# EAGLE design CC-FlexiMIDI-V1R2-12.29.2019 (EAGLE 5.10)

## Sheet 1 of 7
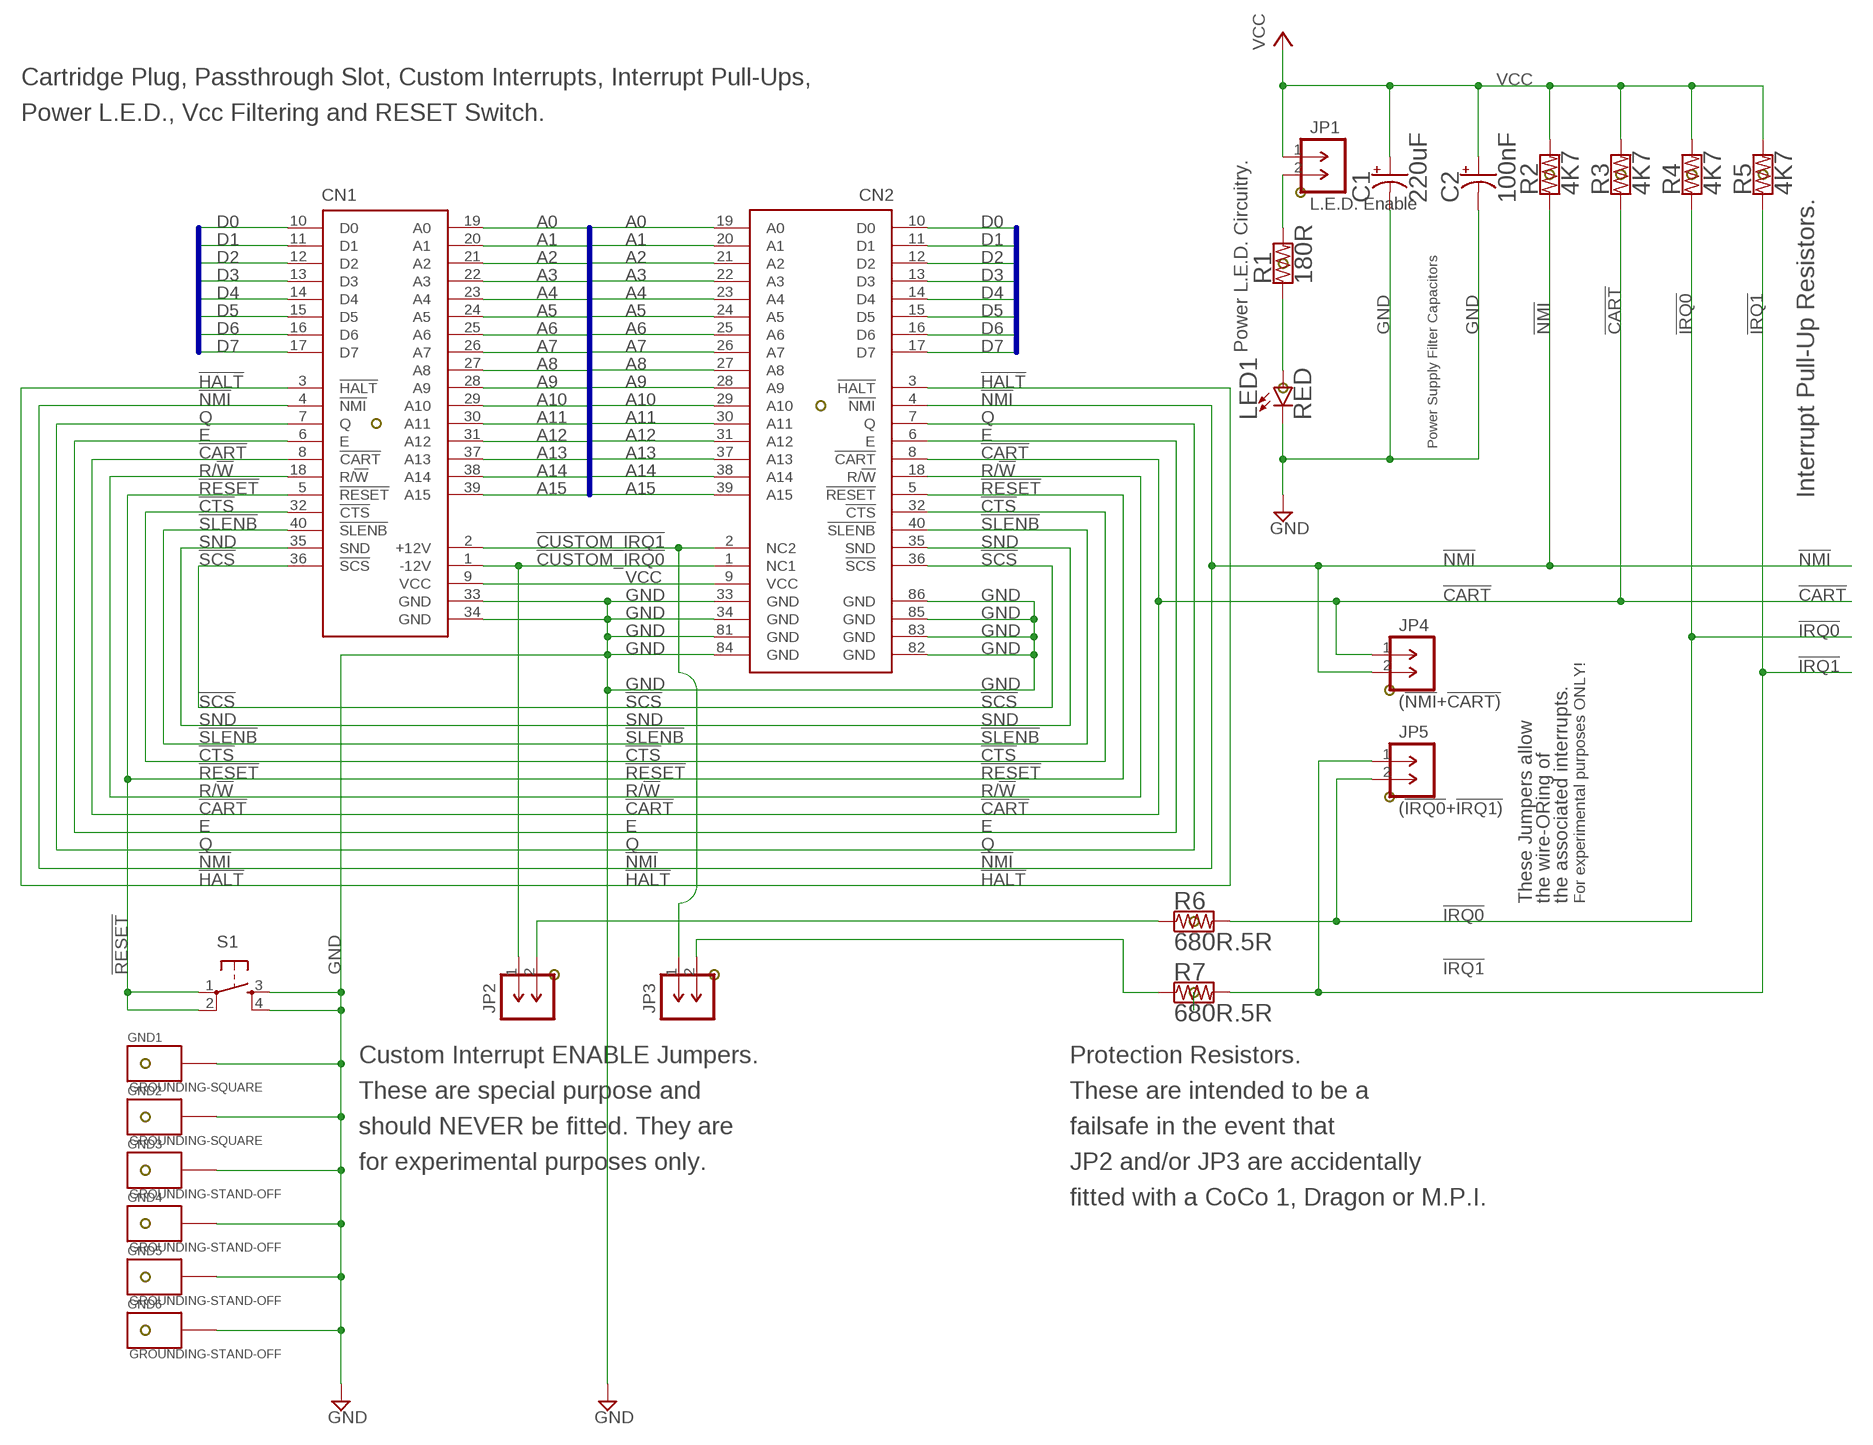
[diagram p0: schematic, sheet 1]

### Parts
C1  220uF  +CAPACITOR--25V2  [25V2]
C2  100nF  +CAPACITOR--PTH1  [PTH1]
CN1  COCO3-CARTRIDGE-PLUG-MEDIUM  [EDGE-CARD-PLUG-2X20-100-MEDIUM]
CN2  COCO3-CARTRIDGE-SLOT-HEADER/SLOT-40  [HEADER/EDGE-CARD-RECEPTACLE-2X20-100-STRAIGHT-W/EARS]
GND1  GROUNDING-SQUARE  [SQUARE]
GND2  GROUNDING-SQUARE  [SQUARE]
GND3  GROUNDING-STAND-OFF  [STAND-OFF]
GND4  GROUNDING-STAND-OFF  [STAND-OFF]
GND5  GROUNDING-STAND-OFF  [STAND-OFF]
GND6  GROUNDING-STAND-OFF  [STAND-OFF]
JP1  L.E.D. Enable  1X02-SIP-100-32  [SIL1X02-100]
JP2  1X02-SIP-100-32  [SIL1X02-100]
JP3  1X02-SIP-100-32  [SIL1X02-100]
JP4  (!NMI!+!CART)  1X02-SIP-100-32  [SIL1X02-100]
JP5  (!IRQ0!+!IRQ1)  1X02-SIP-100-32  [SIL1X02-100]
LED1  RED  LED-5MM  [LT1-3/4]
R1  180R  RESISTOR-LCR5  [LCR5]
R2  4K7  RESISTOR-LCR5  [LCR5]
R3  4K7  RESISTOR-LCR5  [LCR5]
R4  4K7  RESISTOR-LCR5  [LCR5]
R5  4K7  RESISTOR-LCR5  [LCR5]
R6  680R.5R  RESISTOR-R5-PTH  [R5-PTH]
R7  680R.5R  RESISTOR-R5-PTH  [R5-PTH]
S1  RESET  TAC_SWITCHPTH  [TACTILE-PTH]

### Nets
!CART: CN1.8(!CART) CN2.8(!CART) JP4.1 R3.1 ; also sheet 4
!CTS: CN1.32(!CTS) CN2.32(!CTS)
!CUSTOM_IRQ0 [power]: CN1.1(-12V) CN2.1(NC1) JP2.1
!CUSTOM_IRQ1 [power]: CN1.2(+12V) CN2.2(NC2) JP3.1
!HALT: CN1.3(!HALT) CN2.3(!HALT)
!IRQ0: JP5.2 R4.1 R6.2 ; also sheet 4
!IRQ1: JP5.1 R5.1 R7.2 ; also sheet 4
!NMI: CN1.4(!NMI) CN2.4(!NMI) JP4.2 R2.1 ; also sheet 4
!RESET: CN1.5(!RESET) CN2.5(!RESET) S1.1 S1.2 ; also sheet 2,3,4
!SCS: CN1.36(!SCS) CN2.36(!SCS)
!SLENB: CN1.40(!SLENB) CN2.40(!SLENB)
A0: CN1.19(A0) CN2.19(A0) ; also sheet 4
A1: CN1.20(A1) CN2.20(A1) ; also sheet 3
A2: CN1.21(A2) CN2.21(A2) ; also sheet 3
A3: CN1.22(A3) CN2.22(A3) ; also sheet 3
A4: CN1.23(A4) CN2.23(A4) ; also sheet 3
A5: CN1.24(A5) CN2.24(A5) ; also sheet 3
A6: CN1.25(A6) CN2.25(A6) ; also sheet 3
A7: CN1.26(A7) CN2.26(A7) ; also sheet 3
A8: CN1.27(A8) CN2.27(A8) ; also sheet 3
A9: CN1.28(A9) CN2.28(A9) ; also sheet 3
A10: CN1.29(A10) CN2.29(A10) ; also sheet 3
A11: CN1.30(A11) CN2.30(A11) ; also sheet 3
A12: CN1.31(A12) CN2.31(A12) ; also sheet 3
A13: CN1.37(A13) CN2.37(A13) ; also sheet 3
A14: CN1.38(A14) CN2.38(A14) ; also sheet 3
A15: CN1.39(A15) CN2.39(A15) ; also sheet 3
D0: CN1.10(D0) CN2.10(D0) ; also sheet 4
D1: CN1.11(D1) CN2.11(D1) ; also sheet 4
D2: CN1.12(D2) CN2.12(D2) ; also sheet 4
D3: CN1.13(D3) CN2.13(D3) ; also sheet 4
D4: CN1.14(D4) CN2.14(D4) ; also sheet 4
D5: CN1.15(D5) CN2.15(D5) ; also sheet 4
D6: CN1.16(D6) CN2.16(D6) ; also sheet 4
D7: CN1.17(D7) CN2.17(D7) ; also sheet 4
E: CN1.6(E) CN2.6(E) ; also sheet 3,4
GND [power]: C1.- C2.- CN1.33(GND) CN1.34(GND) CN2.33(GND) CN2.34(GND) CN2.81(GND) CN2.82(GND) CN2.83(GND) CN2.84(GND) CN2.85(GND) CN2.86(GND) GND1.GND GND2.GND GND3.GND GND4.GND GND5.GND GND6.GND LED1.-(C) S1.3 S1.4 ; also sheet 2,3,4,5,6,7
N$1: LED1.+(A) R1.1
N$2: JP1.2 R1.2
N$3 [power]: JP2.2 R6.1
N$4 [power]: JP3.2 R7.1
Q: CN1.7(Q) CN2.7(Q)
R/!W: CN1.18(R/!W) CN2.18(R/!W) ; also sheet 4
SND: CN1.35(SND) CN2.35(SND)
VCC [power]: C1.+ C2.+ CN1.9(VCC) CN2.9(VCC) JP1.1 R2.2 R3.2 R4.2 R5.2 ; also sheet 2,3,4,5,6,7

### Buses
A[0..15]
D[0..7]

### Notes on the sheet
- Cartridge Plug, Passthrough Slot, Custom Interrupts, Interrupt Pull-Ups,
- Power L.E.D., Vcc Filtering and RESET Switch.
- Power L.E.D. Circuitry.
- Power Supply Filter Capacitors
- Interrupt Pull-Up Resistors.
- These Jumpers allow | the wire-ORing of | the associated interrupts. | For experimental purposes ONLY!
- Custom Interrupt ENABLE Jumpers. | Protection Resistors.
- These are special purpose and | These are intended to be a
- should NEVER be fitted. They are | failsafe in the event that
- for experimental purposes only. | JP2 and/or JP3 are accidentally
- fitted with a CoCo 1, Dragon or M.P.I.

## Sheet 2 of 7
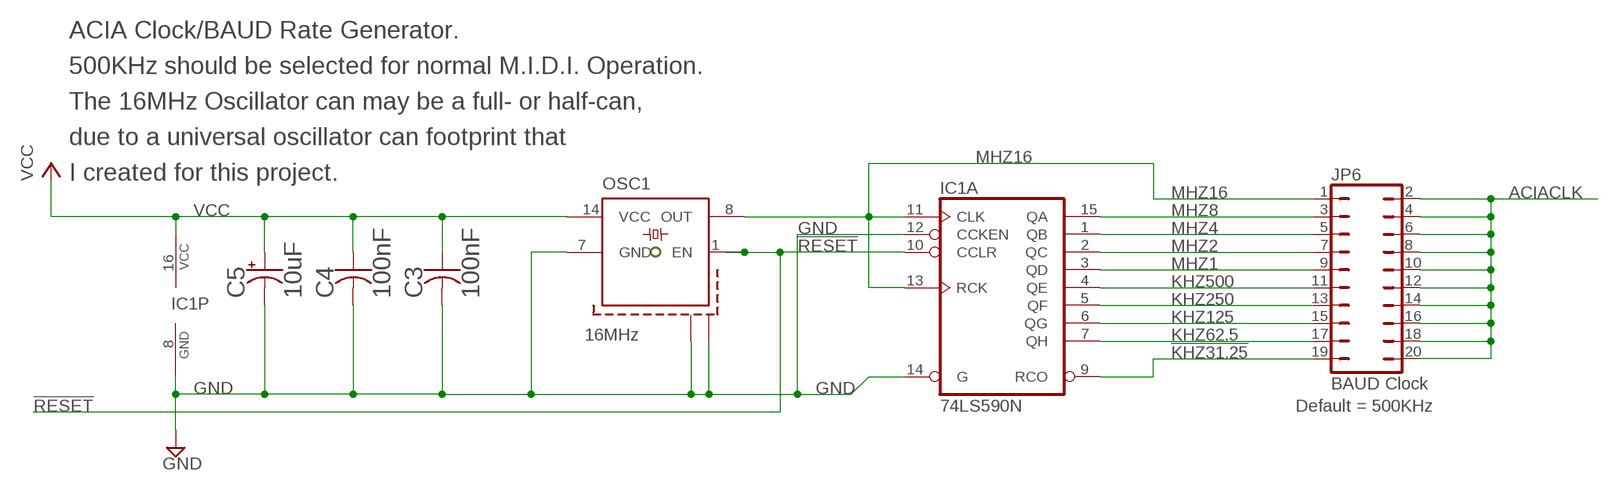
[diagram p1: schematic, sheet 2]

### Parts
C3  100nF  CAPACITOR-PTH1  [PTH1]
C4  100nF  CAPACITOR-PTH1  [PTH1]
C5  10uF  +CAPACITOR--25V1  [25V1]
IC1  74LS590N  [DIL16-3-TOP]
JP6  BAUD Clock  JP10Q  [JP10Q]
OSC1  16MHz  OSC-1  [OSC-TOP]

### Nets
!KHZ31.25: IC1.9(A:RCO) JP6.19
!RESET: IC1.10(A:CCLR) OSC1.1(EN) OSC1.4(EN) ; also sheet 1,3,4
ACIACLK: JP6.2 JP6.4 JP6.6 JP6.8 JP6.10 JP6.12 JP6.14 JP6.16 JP6.18 JP6.20 ; also sheet 4
GND [power]: C3.- C4.- C5.- IC1.8(P:GND) IC1.12(A:CCKEN) IC1.14(A:G) OSC1.7(GND) OSC1.S OSC1.S@1(S) ; also sheet 1,3,4,5,6,7
KHZ62.5: IC1.7(A:QH) JP6.17
KHZ125: IC1.6(A:QG) JP6.15
KHZ250: IC1.5(A:QF) JP6.13
KHZ500: IC1.4(A:QE) JP6.11
MHZ1: IC1.3(A:QD) JP6.9
MHZ2: IC1.2(A:QC) JP6.7
MHZ4: IC1.1(A:QB) JP6.5
MHZ8: IC1.15(A:QA) JP6.3
MHZ16: IC1.11(A:CLK) IC1.13(A:RCK) JP6.1 OSC1.8(OUT)
VCC [power]: C3.+ C4.+ C5.+ IC1.16(P:VCC) OSC1.11(VCC) ; also sheet 1,3,4,5,6,7

### Notes on the sheet
- ACIA Clock/BAUD Rate Generator.
- 500KHz should be selected for normal M.I.D.I. Operation.
- The 16MHz Oscillator can may be a full- or half-can,
- due to a universal oscillator can footprint that
- I created for this project.
- Default = 500KHz

## Sheet 3 of 7
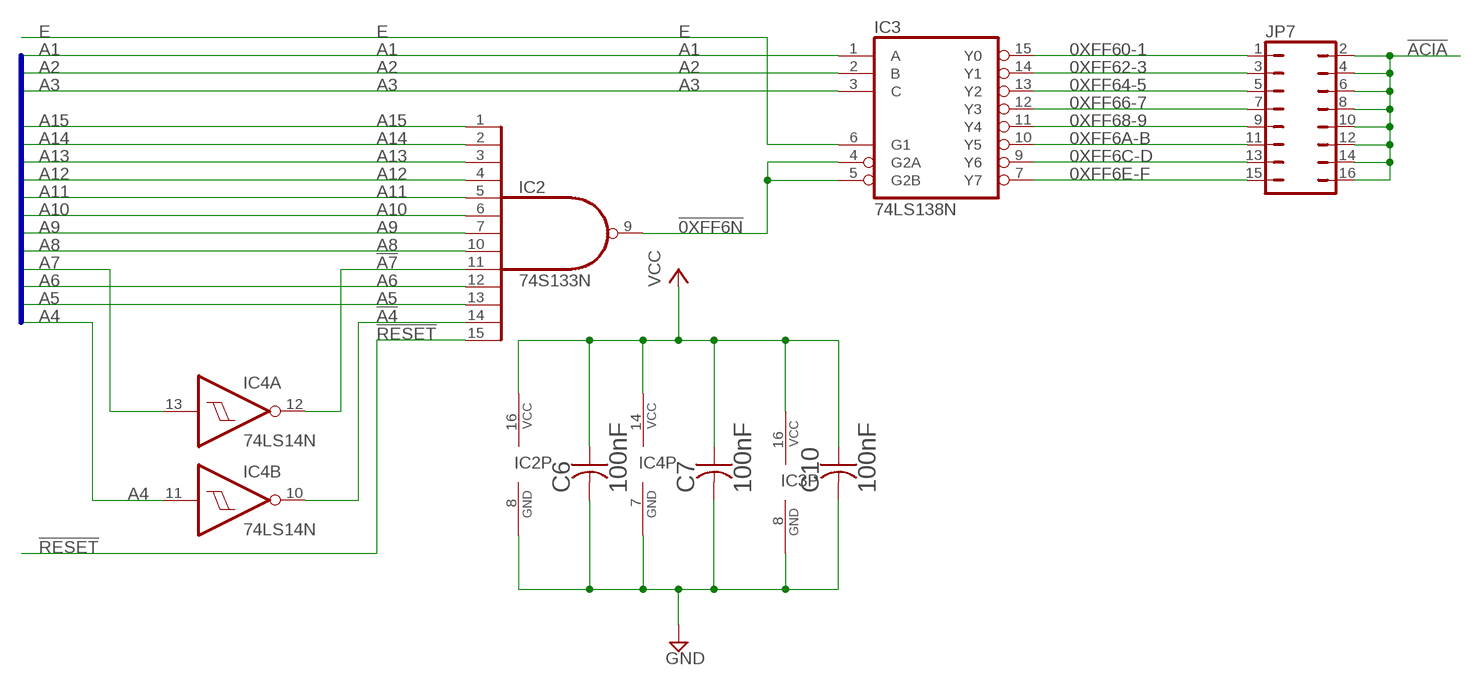
[diagram p2: schematic, sheet 3]

### Parts
C6  100nF  CAPACITOR-PTH1  [PTH1]
C7  100nF  CAPACITOR-PTH1  [PTH1]
C10  100nF  CAPACITOR-PTH1  [PTH1]
IC2  74S133N  [DIL16-3]
IC3  74LS138N  [DIL16-3]
IC4  74LS14N  [DIL14-3-TOP]
JP7  JP8Q  [JP8Q]

### Nets
0XFF6A-B: IC3.10(Y5) JP7.11
0XFF6C-D: IC3.9(Y6) JP7.13
0XFF6E-F: IC3.7(Y7) JP7.15
0XFF60-1: IC3.15(Y0) JP7.1
0XFF62-3: IC3.14(Y1) JP7.3
0XFF64-5: IC3.13(Y2) JP7.5
0XFF66-7: IC3.12(Y3) JP7.7
0XFF68-9: IC3.11(Y4) JP7.9
!0XFF6N: IC2.9(O) IC3.4(G2A) IC3.5(G2B)
!A4: IC2.14(I11) IC4.10(B:O)
!A7: IC2.11(I8) IC4.12(A:O)
!ACIA: JP7.2 JP7.4 JP7.6 JP7.8 JP7.10 JP7.12 JP7.14 JP7.16 ; also sheet 4
!RESET: IC2.15(I12) ; also sheet 1,2,4
A1: IC3.1(A) ; also sheet 1
A2: IC3.2(B) ; also sheet 1
A3: IC3.3(C) ; also sheet 1
A4: IC4.11(B:I) ; also sheet 1
A5: IC2.13(I10) ; also sheet 1
A6: IC2.12(I9) ; also sheet 1
A7: IC4.13(A:I) ; also sheet 1
A8: IC2.10(I7) ; also sheet 1
A9: IC2.7(I6) ; also sheet 1
A10: IC2.6(I5) ; also sheet 1
A11: IC2.5(I4) ; also sheet 1
A12: IC2.4(I3) ; also sheet 1
A13: IC2.3(I2) ; also sheet 1
A14: IC2.2(I1) ; also sheet 1
A15: IC2.1(I0) ; also sheet 1
E: IC3.6(G1) ; also sheet 1,4
GND [power]: C6.- C7.- C10.- IC2.8(GND) IC3.8(GND) IC4.7(P:GND) ; also sheet 1,2,4,5,6,7
VCC [power]: C6.+ C7.+ C10.+ IC2.16(VCC) IC3.16(VCC) IC4.14(P:VCC) ; also sheet 1,2,4,5,6,7

### Buses
A[0..15]

## Sheet 4 of 7
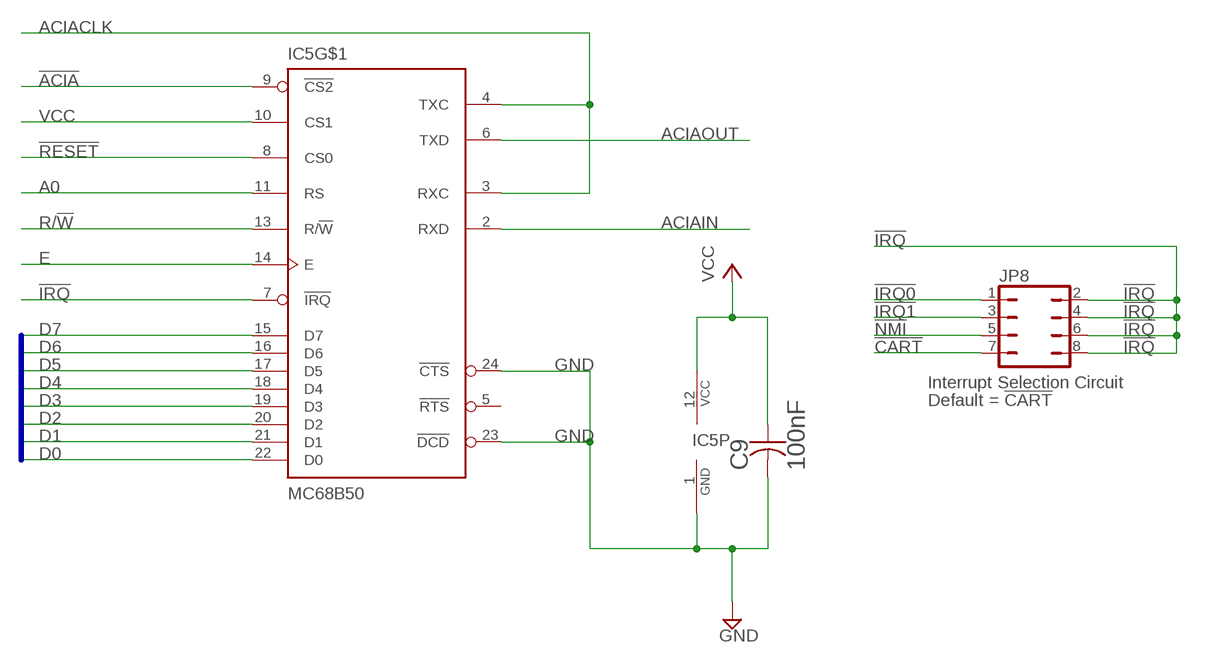
[diagram p3: schematic, sheet 4]

### Parts
C9  100nF  CAPACITOR-PTH1  [PTH1]
IC5  MC68B50  6850P  [DIL24-6]
JP8  JP4Q  [JP4Q]

### Nets
!ACIA: IC5.9(!CS2) ; also sheet 3
!CART: JP8.7 ; also sheet 1
!IRQ: IC5.7(!IRQ) JP8.2 JP8.4 JP8.6 JP8.8
!IRQ0: JP8.1 ; also sheet 1
!IRQ1: JP8.3 ; also sheet 1
!NMI: JP8.5 ; also sheet 1
!RESET: IC5.8(CS0) ; also sheet 1,2,3
A0: IC5.11(RS) ; also sheet 1
ACIACLK: IC5.3(RXC) IC5.4(TXC) ; also sheet 2
ACIAIN: IC5.2(RXD) ; also sheet 5,7
ACIAOUT: IC5.6(TXD) ; also sheet 6
D0: IC5.22(D0) ; also sheet 1
D1: IC5.21(D1) ; also sheet 1
D2: IC5.20(D2) ; also sheet 1
D3: IC5.19(D3) ; also sheet 1
D4: IC5.18(D4) ; also sheet 1
D5: IC5.17(D5) ; also sheet 1
D6: IC5.16(D6) ; also sheet 1
D7: IC5.15(D7) ; also sheet 1
E: IC5.14(E) ; also sheet 1,3
GND [power]: C9.- IC5.1(P:GND) IC5.23(!DCD) IC5.24(!CTS) ; also sheet 1,2,3,5,6,7
R/!W: IC5.13(R/!W) ; also sheet 1
VCC [power]: C9.+ IC5.10(CS1) IC5.12(P:VCC) ; also sheet 1,2,3,5,6,7
Unconnected: IC5.5(!RTS)

### Buses
D[0..7]

### Notes on the sheet
- Interrupt Selection Circuit
- Default = !CART

## Sheet 5 of 7
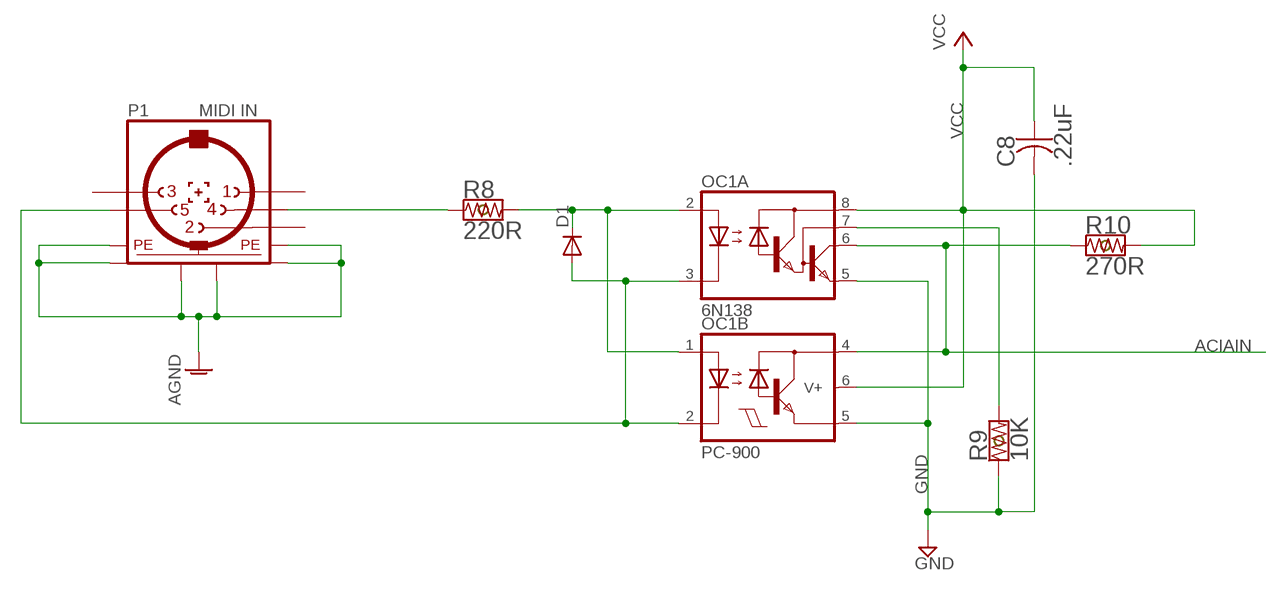
[diagram p4: schematic, sheet 5]

### Parts
C8  .22uF  CAPACITOR-PTH1  [PTH1]
D1  1N4148DO35-7  [DO35-7]
OC1A  6N138  6N138-T  [DIL08-3-TOP]
OC1B  PC-900  [DIL06-3-TOP]
P1  MIDI IN  5-PIN-90-DEGREE-FEMALE-DIN-5P90D  [5-PIN-90-DEGREE-FEMALE-DIN]
R8  220R  RESISTOR-LCR5  [LCR5]
R9  10K  RESISTOR-LCR5  [LCR5]
R10  270R  RESISTOR-LCR5  [LCR5]

### Nets
ACIAIN: OC1A.6(VO) OC1B.4(COLLECTOR) R10.1 ; also sheet 4,7
AGND [power]: P1.PE@1(PE) P1.PE@2(PE) P1.PE@3(PE) P1.PE@4(PE) P1.PE@5(PE) P1.PE@6(PE)
GND [power]: C8.- OC1A.5(GND) OC1B.5(EMITTER) R9.1 ; also sheet 1,2,3,4,6,7
N$13: D1.C OC1A.2(A) OC1B.1(A) R8.2
N$14: D1.A OC1A.3(C) OC1B.2(C) P1.5
N$18: P1.4 R8.1
N$19: OC1A.7(VB) R9.2
VCC [power]: C8.+ OC1A.8(VCC) OC1B.6(V+) R10.2 ; also sheet 1,2,3,4,6,7
Unconnected: P1.1 P1.2 P1.3

## Sheet 6 of 7
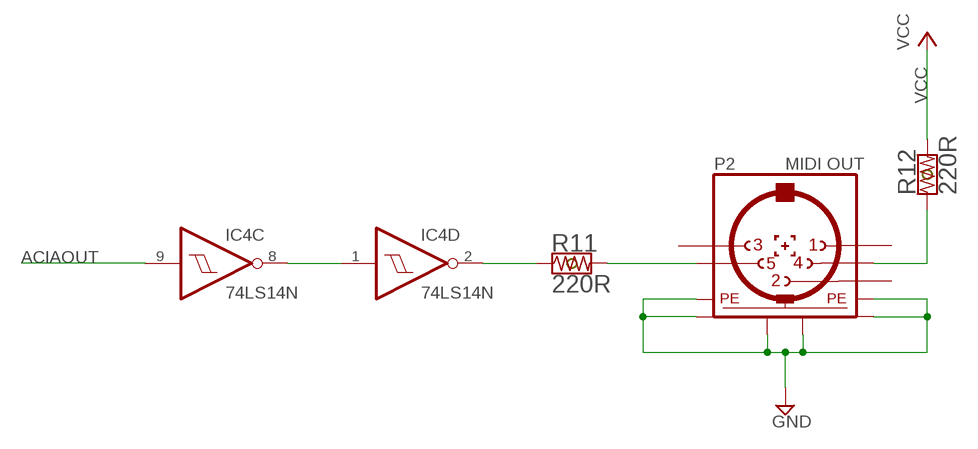
[diagram p5: schematic, sheet 6]

### Parts
P2  MIDI OUT  5-PIN-90-DEGREE-FEMALE-DIN-5P90D  [5-PIN-90-DEGREE-FEMALE-DIN]
R11  220R  RESISTOR-LCR5  [LCR5]
R12  220R  RESISTOR-LCR5  [LCR5]

### Nets
ACIAOUT: IC4.9(C:I) ; also sheet 4
GND [power]: P2.PE@1(PE) P2.PE@2(PE) P2.PE@3(PE) P2.PE@4(PE) P2.PE@5(PE) P2.PE@6(PE) ; also sheet 1,2,3,4,5,7
N$15: IC4.1(D:I) IC4.8(C:O)
N$16: IC4.2(D:O) R11.1
N$17: P2.5 R11.2
N$20: P2.4 R12.1
VCC [power]: R12.2 ; also sheet 1,2,3,4,5,7
Unconnected: P2.1 P2.2 P2.3

## Sheet 7 of 7
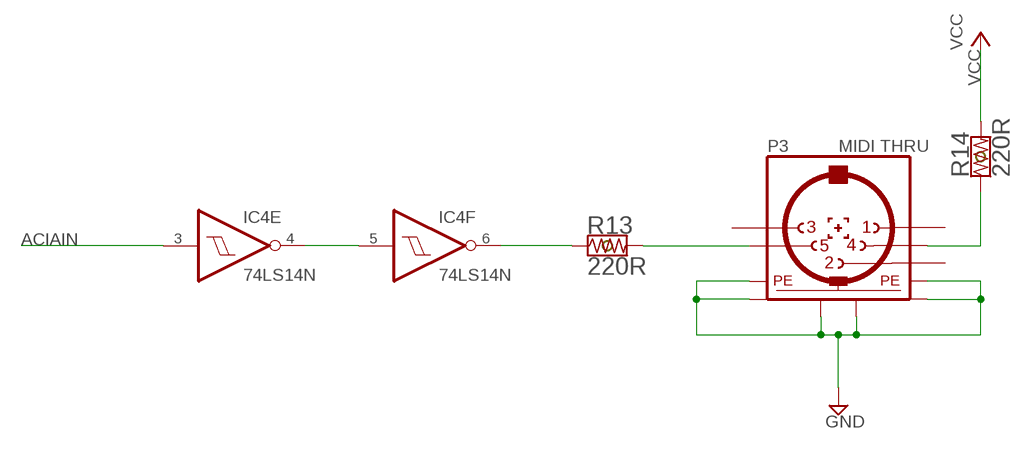
[diagram p6: schematic, sheet 7]

### Parts
P3  MIDI THRU  5-PIN-90-DEGREE-FEMALE-DIN-5P90D  [5-PIN-90-DEGREE-FEMALE-DIN]
R13  220R  RESISTOR-LCR5  [LCR5]
R14  220R  RESISTOR-LCR5  [LCR5]

### Nets
ACIAIN: IC4.3(E:I) ; also sheet 4,5
GND [power]: P3.PE@1(PE) P3.PE@2(PE) P3.PE@3(PE) P3.PE@4(PE) P3.PE@5(PE) P3.PE@6(PE) ; also sheet 1,2,3,4,5,6
N$21: P3.4 R14.1
N$22: P3.5 R13.2
N$23: IC4.6(F:O) R13.1
N$24: IC4.4(E:O) IC4.5(F:I)
VCC [power]: R14.2 ; also sheet 1,2,3,4,5,6
Unconnected: P3.1 P3.2 P3.3

## Power pins joined to a net without a drawn wire
VCC: OSC1.14(VCC)

## Library data of the parts
C1 C2 C5 = CC-FlexiMIDI-V1R1-03.09.2009:+CAPACITOR-: Capacitor Polarized These are standard SMD and PTH capacitors. Normally 10uF, 47uF, and 100uF in electrolytic and tantalum varieties. Always verify the external diameter of the through hole cap, it varies with capacity, voltage, and manufacturer. The EIA devices should be standard.
C3 C4 C6-C10 = CC-FlexiMIDI-V1R1-03.09.2009:CAPACITOR: NON-POLARIZED CAPACITOR grid 5mm
CN1 = CC-FlexiMIDI-V1R1-03.09.2009:COCO3-CARTRIDGE-PLUG: CoCo 3 Program Pak Cartridge Plug - http://www.GIMEchip.com/ Tandy Radio Shack TRS-80 Color Computer 3 Program Pak Cartridge Plug (Edge-Card) E.A.G.L.E. Library Part created by John Eric Turner & His Father - sales@gimechip.com <mailto:sales@gimechip.com?subject=Tandy Radio Shack TRS- 80 Color Computer 3 Program Pak Cartridge Plug (Edge-Card) E.A.G.L.E. Library Part> 40-Pin Edge-Card sharing the same pinout as the Program Pak Cartridge Edge-Card Connector. This library part has been designed to provide a 40-pin cartridge plug connector matching the CoCo's Edge-Card connector (Cartridge Slot). This library part is also useful with the Dragon and other CoCo clones. It is important to note that the CoCo 2 & 3 only provide +5V at the cartridge connector. The CoCo 1 provides +5V AND +/-12V at the cartridge connector. The Dragon provides only +5V and +12V at the cartridge connector. The table below lists all similarities and differences between these machines, relevant to the cartridge slot: PIN # TRS-80 "CoCo 1" Function Tano/Dragon Data "Dragon 32/64" Function TRS-80 "CoCo 2 & 3" Function 1 -12V +12V NC 2 +12V +12V NC 3 HALT* HALT* HALT* 4 NMI* NMI* NMI* 5 RESET* RESET* RESET* 6 E E E 7 Q Q Q 8 CART* CART* CART* 9 +5V +5V +5V 10 D0 D0 D0 11 D1 D1 D1 12 D2 D2 D2 13 D3 D3 D3 14 D4 D4 D4 15 D5 D5 D5 16 D6 D6 D6 17 D7 D7 D7 18 R/W* R/W* R/W* 19 A0 A0 A0 20 A1 A1 A1 21 A2 A2 A2 22 A3 A3 A3 23 A4 A4 A4 24 A5 A5 A5 25 A6 A6 A6 26 A7 A7 A7 27 A8 A8 A8 28 A9 A9 A9 29 A10 A10 A10 30 A11 A11 A11 31 A12 A12 A12 32 CTS* CSEL* CTS* 33 GND GND GND 34 GND GND GND 35 SND SND SND 36 SCS* P2* SCS* 37 A13 A13 A13 38 A14 A14 A14 39 A15 A15 A15 40 SLENB* DSD* SLENB*
CN2 = CC-FlexiMIDI-V1R1-03.09.2009:COCO3-CARTRIDGE-SLOT: CoCo 3 Program Pak Cartridge Slot HEADER/SLOT - http://www.GIMEchip.com/ Tandy Radio Shack TRS-80 Color Computer 3 Program Pak Cartridge Slot HEADER/SLOT E.A.G.L.E. Library Part created by John Eric Turner & His Father - sales@gimechip.com <mailto:sales@gimechip.com?subject=Tandy Radio Shack TRS- 80 Color Computer 3 Program Pak Cartridge Slot E.A.G.L.E. Library Part> 40-Pin Header and Slot sharing the same pinout as the Program Pak Cartridge Edge-Card Connector. This library part has been designed to provide a 40-pin cartridge slot connector matching the CoCo's Edge-Card connector (Cartridge Slot). This library part is also useful with the Dragon and other CoCo clones. It is important to note that the CoCo 2 & 3 only provide +5V at the cartridge connector. The CoCo 1 provides +5V AND +/-12V at the cartridge connector. The Dragon provides only +5V and +12V at the cartridge connector. The table below lists all similarities and differences between these machines, relevant to the cartridge slot: PIN # TRS-80 "CoCo 1" Function Tano/Dragon Data "Dragon 32/64" Function TRS-80 "CoCo 2 & 3" Function 1 -12V +12V NC 2 +12V +12V NC 3 HALT* HALT* HALT* 4 NMI* NMI* NMI* 5 RESET* RESET* RESET* 6 E E E 7 Q Q Q 8 CART* CART* CART* 9 +5V +5V +5V 10 D0 D0 D0 11 D1 D1 D1 12 D2 D2 D2 13 D3 D3 D3 14 D4 D4 D4 15 D5 D5 D5 16 D6 D6 D6 17 D7 D7 D7 18 R/W* R/W* R/W* 19 A0 A0 A0 20 A1 A1 A1 21 A2 A2 A2 22 A3 A3 A3 23 A4 A4 A4 24 A5 A5 A5 25 A6 A6 A6 26 A7 A7 A7 27 A8 A8 A8 28 A9 A9 A9 29 A10 A10 A10 30 A11 A11 A11 31 A12 A12 A12 32 CTS* CSEL* CTS* 33 GND GND GND 34 GND GND GND 35 SND SND SND 36 SCS* P2* SCS* 37 A13 A13 A13 38 A14 A14 A14 39 A15 A15 A15 40 SLENB* DSD* SLENB*
D1 = CC-FlexiMIDI-V1R1-03.09.2009:1N4148: DIODE high speed (Philips)
GND1-GND6 = CC-FlexiMIDI-V1R1-03.09.2009:GROUNDING
IC1 = CC-FlexiMIDI-V1R1-03.09.2009:74*590: 8-bit binary COUNTER, output register
IC2 = CC-FlexiMIDI-V1R1-03.09.2009:74*133: 13-input NAND gate
IC3 = CC-FlexiMIDI-V1R1-03.09.2009:74*138: 3-line to 8-line DECODER/DEMULTIPLEXER
IC4 = CC-FlexiMIDI-V1R1-03.09.2009:74*14: Hex schmitt trigger INVERTER
IC5 = CC-FlexiMIDI-V1R1-03.09.2009:6850: MC6850 - http://www.TCADT.com/ MC6850 - ASYNCHRONOUS COMMUNICATIONS INTERFACE ADAPTER (ACIA) E.A.G.L.E. Library Part created by Ivan Bliminse - TinCansAndDuctTape@OutLook.com <mailto:TinCansAndDuctTape@OutLook.com?subject=MC6850 - ASYNCHRONOUS COMMUNICATIONS INTERFACE ADAPTER (ACIA) E.A.G.L.E. Library Part> COMPATIBILITY This E.A.G.L.E. Library Part is compatible with all variants of the 6850 in the 24-pin DIP package, including the following: Manufacturer Type Process Clock Frequency Package Motorola Freescale Semiconductors MC6850L MC6850CL MC68A50L MC68A50CL MC68B50C MOS (N-CHANNEL, SILICON-GATE) 1.0 MHz 1.0 MHz 1.5 MHz 1.5 MHz 2.0 MHz Ceramic L Suffix Motorola Freescale Semiconductors MC6850S MC6850CS MC68A50S MC68A50CS MC68B50S MOS (N-CHANNEL, SILICON-GATE) 1.0 MHz 1.0 MHz 1.5 MHz 1.5 MHz 2.0 MHz Cerdip S Suffix Motorola Freescale Semiconductors MC6850P MC6850CP MC68A50P MC68A50CP MC68B50P MOS (N-CHANNEL, SILICON-GATE) 1.0 MHz 1.0 MHz 1.5 MHz 1.5 MHz 2.0 MHz Plastic P Suffix Hitachi Semiconductors HD6350P HD63A50P HD63B50P HD63C50P CMOS 1.0 MHz 1.5 MHz 2.0 MHz 3.0 MHz DP-24 Hitachi Semiconductors HD6350FP HD63A50FP HD63B50FP HD63C50FP CMOS 1.0 MHz 1.5 MHz 2.0 MHz 3.0 MHz FP-24D Hitachi Semiconductors HD6850 HD68A50 HD68B50 NMOS 1.0 MHz 1.5 MHz 2.0 MHz DC-24 Hitachi Semiconductors HD6850P HD68A50P HD68B50P NMOS 1.0 MHz 1.5 MHz 2.0 MHz DP-24 NOTE: The Hitachi "C" parts are officially rated at 3 MHz, however, they are designed to operate at up to 5 MHz clock speeds. MOTOROLA (FREESCALE) SEMICONDUCTORS MC6850 - MOS (N-CHANNEL, SILICON-GATE) ASYNCHRONOUS COMMUNICATIONS INTERFACE ADAPTER The MC6850 Asynchronous Communications Interface Adapter provides the data formatting and control to interface serial asynchronous data communications information to bus organized systems such as the MC6800 and MC6809 Microprocessing Units. The bus interface of the MC6850 includes select, enable, read/write, interrupt and bus interface logic to allow data transfer over an 8-bit bidirectional data bus. The parallel data of the bus system is serially transmitted and received by the asynchronous data interface, with proper formatting and error checking. The functional configuration of the ACIA is programmed via the data bus during system initialization. A programmable Control Register provides variable word lengths, clock division ratios, transmit control, receive control, and interrupt control. For peripheral or modem operation, three control lines are provided. These lines allow the ACIA to interface directly with the MC6860L 0-600 bps digital modem. FEATURES 8- and 9-Bit Transmission Optional Even and Odd Parity Parity, Overrun and Framing Error Checking Programmable Control Register Optional ÷ 1, ÷ 16, and ÷ 64 Clock Modes Up to 1.0 Mbps Transmission False Start Bit Deletion Peripheral/Modem Control Functions Double Buffered One- or Two-Stop Bit Operation HD6350/HD6850 Series ACIA (Asynchronous Communications Interface Adapter) HD6350 = CMOS, HD6850 = NMOS The HD6350/HD6850 Asynchronous Communications Interface Adapter provides the data formatting and control to interface serial asynchronous data communications information to bus organized systems such as the HMCS6800 Microprocessing Unit (MPU). The bus interface of the HD6350/HD6850 includes select, enable, read/writer, interrupt and bus interface logic to allow data transfer over an 8-bit bi-directional data bus. The parrallel data of the bus system is serially transmitted and received by the asynchronous data interface with proper formatting and error checking. The functional configuration of the ACIA is programmed via the data bus during system initialization. A programmable Control Register provides variable word lengths, clock division ratios, transmit control, receive control, and interrupt control. For peripheral or modern operation three control lines are provided. FEATURES Serial/Parallel Conversion of Data Seven and Eight-bit Transmission Optional Even and Odd Parity Parity, Overrun and Framing Error Checking Peripheral/Modem Control Functions (Clear to Send CTS, Request to Send RTS, Data Carrier Detect DCD) Optional ÷ 1, ÷ 16, and ÷ 64 Clock Modes One-or Two-Stop Bit Operation Double Buffered - HD6350 - Low-Power, High-Speed, High-Density CMOS Compatible with NMOS ACIA (HD6850) Wide Range Operating Voltage (VCC = 5V ±10%) Up to 1Mbps Transmission - HD6850 - Compatible with MC6850 and MC68A50 Up to 500Kbps Transmission
JP1-JP5 = CC-FlexiMIDI-V1R1-03.09.2009:1X02: MALE HEADER
JP6 = CC-FlexiMIDI-V1R1-03.09.2009:JP10Q: JUMPER
JP7 = CC-FlexiMIDI-V1R1-03.09.2009:JP8Q: JUMPER
JP8 = CC-FlexiMIDI-V1R1-03.09.2009:JP4Q: JUMPER
LED1 = CC-FlexiMIDI-V1R1-03.09.2009:LED: LEDs Standard schematic elements and footprints for 5mm, 3mm, 1206, and 0603 sized LEDs. 5mm - Spark Fun Electronics SKU : COM-00529 (and others)
OC1A = CC-FlexiMIDI-V1R1-03.09.2009:6N138: MOTOROLA OPTO COUPLER
OC1B = CC-FlexiMIDI-V1R1-03.09.2009:PC-900
OSC1 = CC-FlexiMIDI-V1R1-03.09.2009:OSC-1
P1-P3 = CC-FlexiMIDI-V1R2-12.29.2019:5-PIN-90-DEGREE-FEMALE-DIN: Female CONNECTOR 5 pins 90 deg. with shield, horizontal (DIN 41524)
R1-R14 = CC-FlexiMIDI-V1R1-03.09.2009:RESISTOR
S1 = CC-FlexiMIDI-V1R1-03.09.2009:TAC_SWITCH: Momentary Tactile Push Switch

## Net classes
0 default: width 0.203 mm, clearance 0.152 mm
1 power: width 0.762 mm, clearance 0.203 mm

## Board
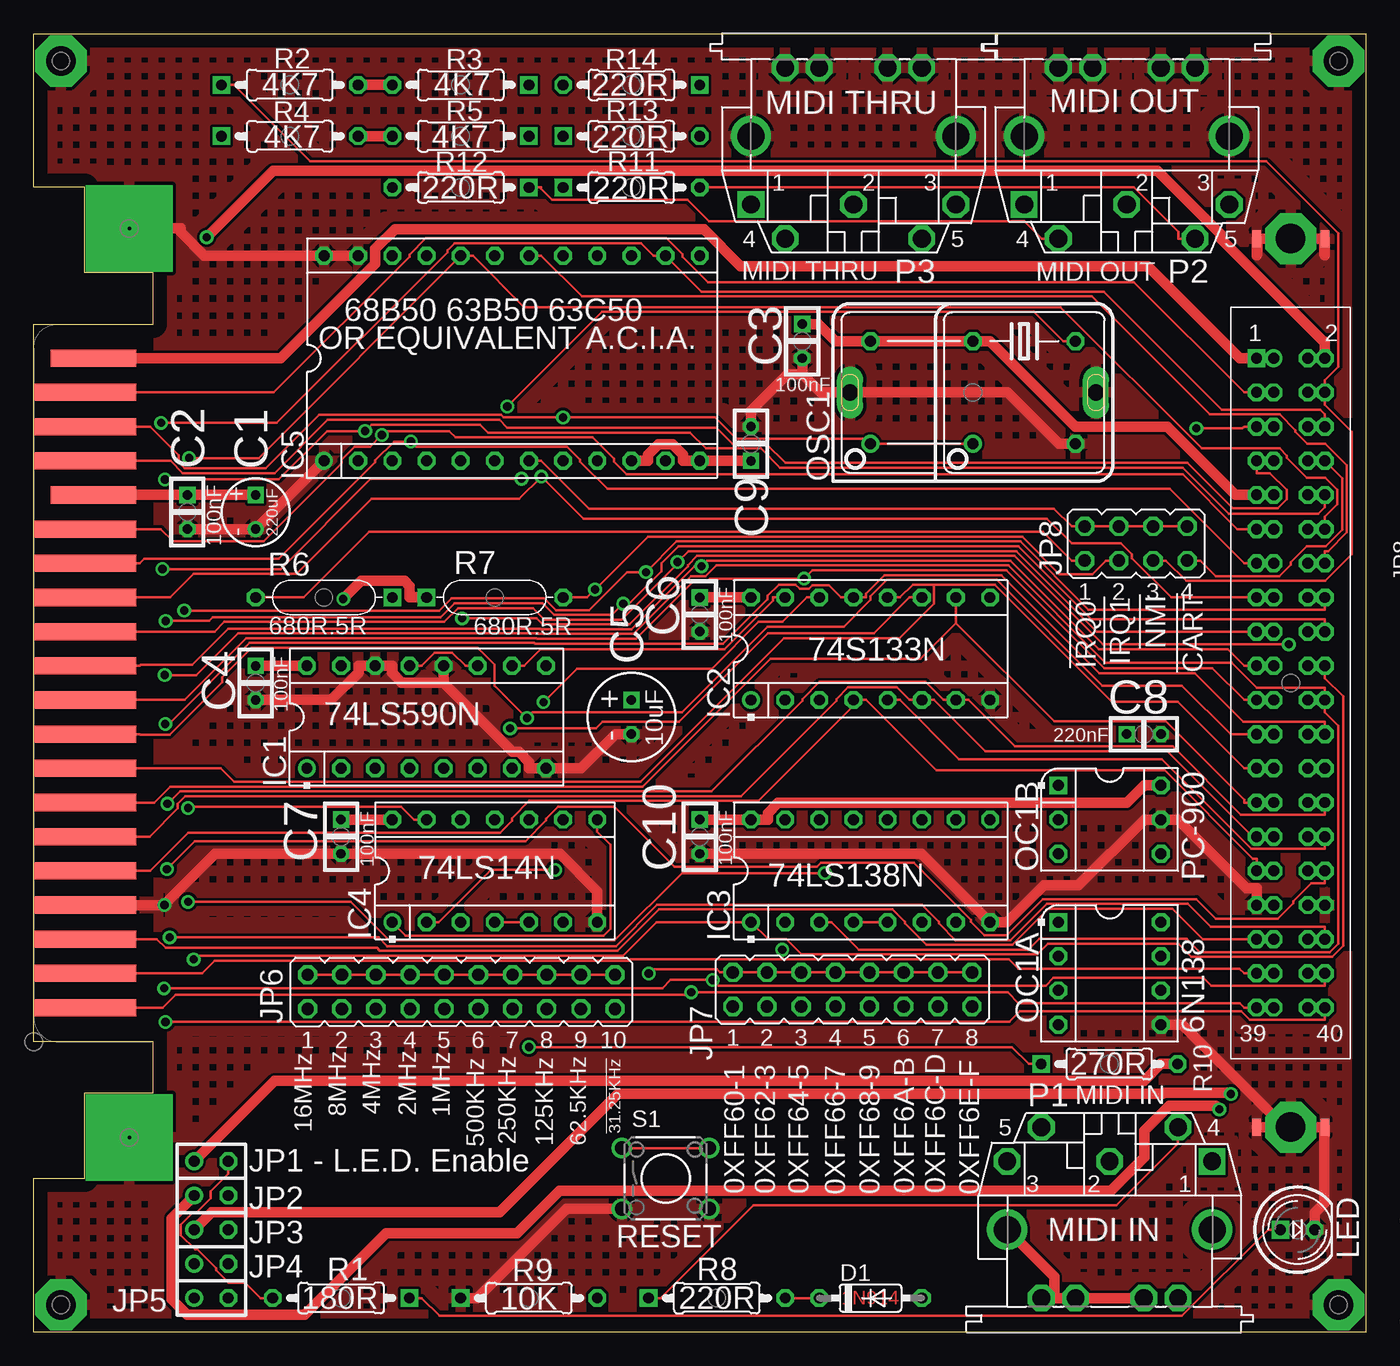
[diagram p7: board, top side]
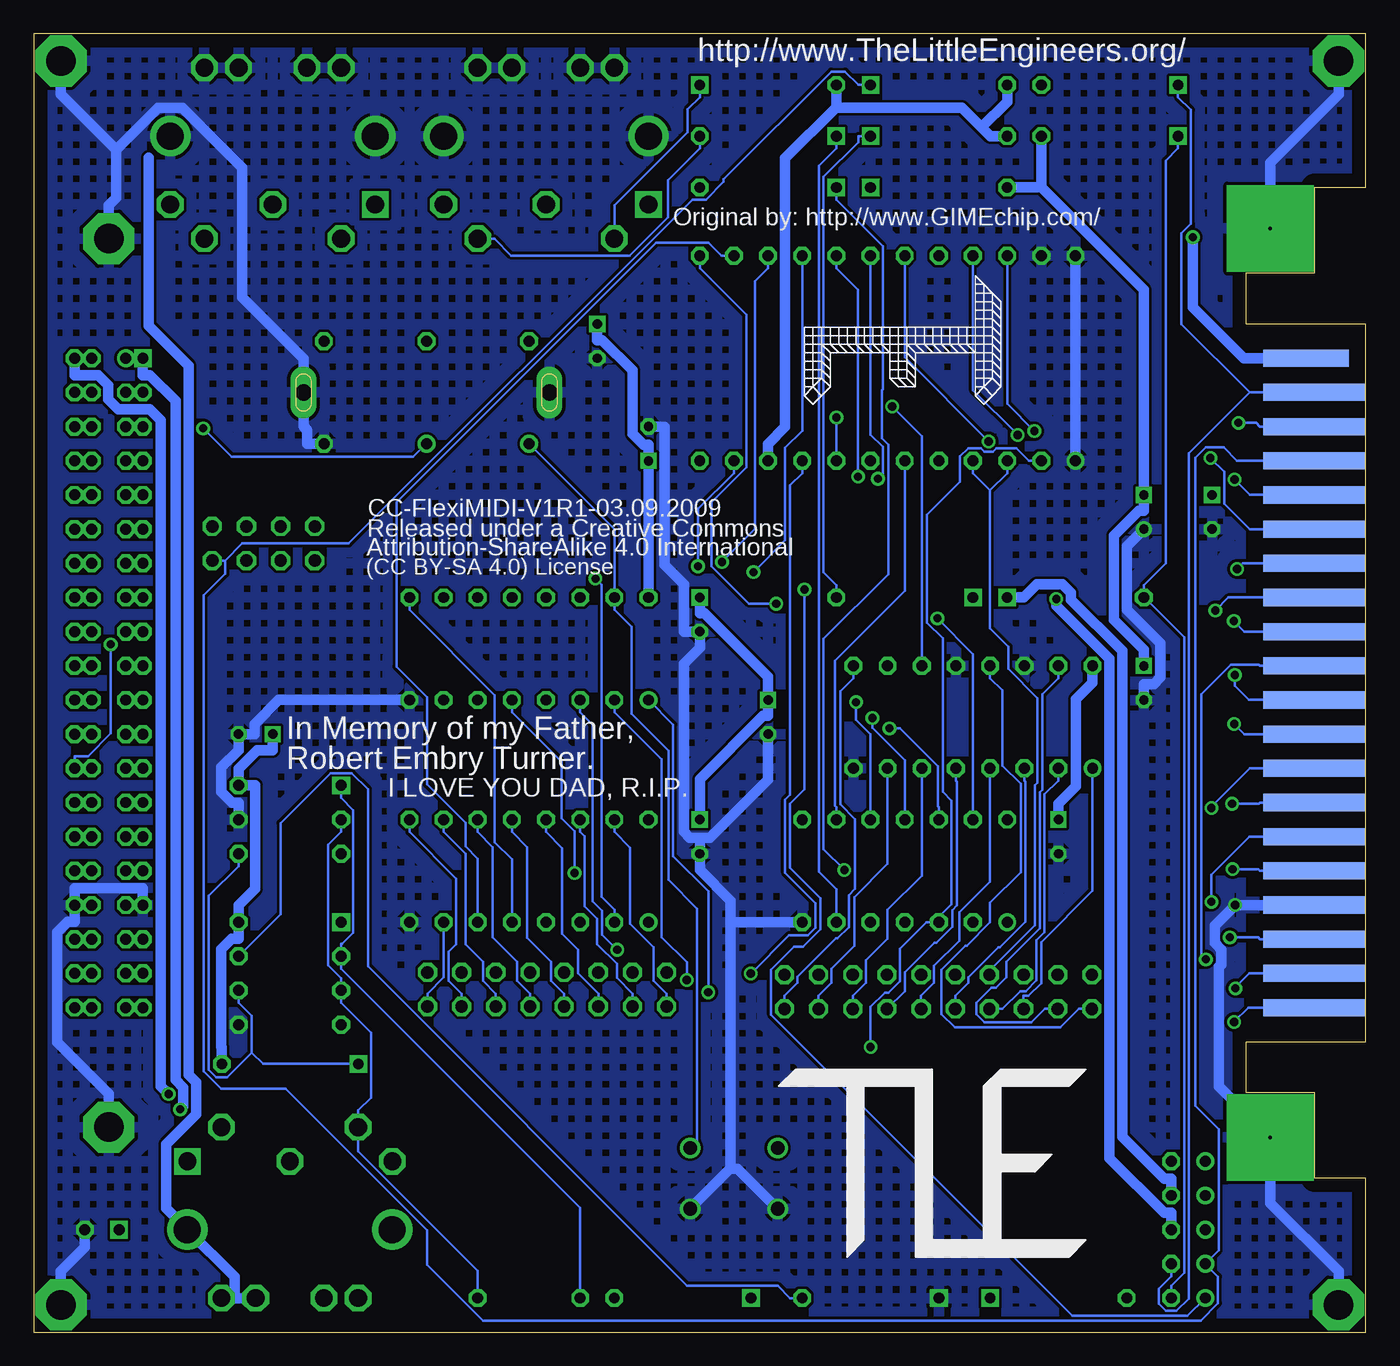
[diagram p8: board, bottom side, seen from below]

Size 99.06 x 96.52 mm. Coordinates in mm from the lower left corner, seen from the top.
Outline: 8.89,21.59 0,21.59 0,74.93 8.89,74.93 8.89,78.74 3.81,78.74 3.81,85.09 0,85.09 0,96.52 99.06,96.52 99.06,0 0,0 0,11.43 3.81,11.43 3.81,17.78 8.89,17.78 8.89,21.59
Copper layers (1*16): Top 0.035mm / dielectric 1.5mm / Bottom 0.035mm
Design rules "default": minimum track width 10mil, minimum drill 24mil, track to track 8mil, track to pad 8mil, pad to pad 8mil, via to via 8mil, smd to smd 8mil, copper to edge 40mil, drill to drill 8mil, minimum pad ring 10mil, minimum via ring 8mil, stop-mask expansion 4mil, vias tented up to drill 0mil, thermal gap 10mil

### Footprints (pad centres in the part's own frame; a part is rotated, then mirrored left to right if it is on the bottom)
25V2 = drill 0.7 square: + 1.27,0 | drill 0.7 round: - -1.27,0
PTH1 = drill 0.7 square: + -1.27,0 | drill 0.7 octagon: - 1.27,0
25V1 = drill 0.7 square: + 1.27,0 | drill 0.7 octagon: - -1.27,0
EDGE-CARD-PLUG-2X20-100-MEDIUM = smd 6.35 x 1.27: 1 4.445,50.8; 9 4.445,40.64 | smd 6.35 x 1.27 bottom: 2 4.445,50.8 | smd 7.62 x 1.27: 3 3.81,48.26; 5 3.81,45.72; 7 3.81,43.18; 11 3.81,38.1; 13 3.81,35.56; 15 3.81,33.02; 17 3.81,30.48; 19 3.81,27.94; 21 3.81,25.4; 23 3.81,22.86; 25 3.81,20.32; 27 3.81,17.78; 29 3.81,15.24; 31 3.81,12.7; 33 3.81,10.16; 35 3.81,7.62; 37 3.81,5.08; 39 3.81,2.54 | smd 7.62 x 1.27 bottom: 4 3.81,48.26; 6 3.81,45.72; 8 3.81,43.18; 10 3.81,40.64; 12 3.81,38.1; 14 3.81,35.56; 16 3.81,33.02; 18 3.81,30.48; 20 3.81,27.94; 22 3.81,25.4; 24 3.81,22.86; 26 3.81,20.32; 28 3.81,17.78; 30 3.81,15.24; 32 3.81,12.7; 34 3.81,10.16; 36 3.81,7.62; 38 3.81,5.08; 40 3.81,2.54
HEADER/EDGE-CARD-RECEPTACLE-2X20-100-STRAIGHT-W/EARS = drill 0.813 square: 1 -24.13,-2.54 | drill 0.813 octagon: 2 -24.13,2.54; 3 -21.59,-2.54; 4 -21.59,2.54; 5 -19.05,-2.54; 6 -19.05,2.54; 7 -16.51,-2.54; 8 -16.51,2.54; 9 -13.97,-2.54; 10 -13.97,2.54; 11 -11.43,-2.54; 12 -11.43,2.54; 13 -8.89,-2.54; 14 -8.89,2.54; 15 -6.35,-2.54; 16 -6.35,2.54; 17 -3.81,-2.54; 18 -3.81,2.54; 19 -1.27,-2.54; 20 -1.27,2.54; 21 1.27,-2.54; 22 1.27,2.54; 23 3.81,-2.54; 24 3.81,2.54; 25 6.35,-2.54; 26 6.35,2.54; 27 8.89,-2.54; 28 8.89,2.54; 29 11.43,-2.54; 30 11.43,2.54; 31 13.97,-2.54; 32 13.97,2.54; 33 16.51,-2.54; 34 16.51,2.54; 35 19.05,-2.54; 36 19.05,2.54; 37 21.59,-2.54; 38 21.59,2.54; 39 24.13,-2.54; 40 24.13,2.54; 42 -24.13,1.27; 43 -21.59,-1.27; 44 -21.59,1.27; 45 -19.05,-1.27; 46 -19.05,1.27; 47 -16.51,-1.27; 48 -16.51,1.27; 49 -13.97,-1.27; 50 -13.97,1.27; 51 -11.43,-1.27; 52 -11.43,1.27; 53 -8.89,-1.27; 54 -8.89,1.27; 55 -6.35,-1.27; 56 -6.35,1.27; 57 -3.81,-1.27; 58 -3.81,1.27; 59 -1.27,-1.27; 60 -1.27,1.27; 61 1.27,-1.27; 62 1.27,1.27; 63 3.81,-1.27; 64 3.81,1.27; 65 6.35,-1.27; 66 6.35,1.27; 67 8.89,-1.27; 68 8.89,1.27; 69 11.43,-1.27; 70 11.43,1.27; 71 13.97,-1.27; 72 13.97,1.27; 73 16.51,-1.27; 74 16.51,1.27; 75 19.05,-1.27; 76 19.05,1.27; 77 21.59,-1.27; 78 21.59,1.27; 79 24.13,-1.27; 80 24.13,1.27 | drill 0.813 round: 41 -24.13,-1.27 | drill 2.2 pad 3.81 octagon: 81 -33.02,0; 84 33.02,0 | smd 1.27 x 0.635: 82 -33.02,2.54; 83 -33.02,-2.54; 85 33.02,2.54; 86 33.02,-2.54
DO35-7 = drill 0.813 octagon: A 3.81,0; C -3.81,0
SQUARE = drill 0.254 pad 6.452 square: GND 0,0
STAND-OFF = drill 2.2 pad 3.81 octagon: GND 0,0
DIL16-3-TOP = drill 0.813 round: 1 -8.89,-3.81 | drill 0.813 octagon: 2 -6.35,-3.81; 3 -3.81,-3.81; 4 -1.27,-3.81; 5 1.27,-3.81; 6 3.81,-3.81; 7 6.35,-3.81; 8 8.89,-3.81; 9 8.89,3.81; 10 6.35,3.81; 11 3.81,3.81; 12 1.27,3.81; 13 -1.27,3.81; 14 -3.81,3.81; 15 -6.35,3.81; 16 -8.89,3.81
DIL16-3 = drill 0.813 round: 1 -8.89,-3.81 | drill 0.813 octagon: 2 -6.35,-3.81; 3 -3.81,-3.81; 4 -1.27,-3.81; 5 1.27,-3.81; 6 3.81,-3.81; 7 6.35,-3.81; 8 8.89,-3.81; 9 8.89,3.81; 10 6.35,3.81; 11 3.81,3.81; 12 1.27,3.81; 13 -1.27,3.81; 14 -3.81,3.81; 15 -6.35,3.81; 16 -8.89,3.81
DIL14-3-TOP = drill 0.813 round: 1 -7.62,-3.81 | drill 0.813 octagon: 2 -5.08,-3.81; 3 -2.54,-3.81; 4 0,-3.81; 5 2.54,-3.81; 6 5.08,-3.81; 7 7.62,-3.81; 8 7.62,3.81; 9 5.08,3.81; 10 2.54,3.81; 11 0,3.81; 12 -2.54,3.81; 13 -5.08,3.81; 14 -7.62,3.81
DIL24-6 = drill 0.813 round: 1 -13.97,-7.62 | drill 0.813 octagon: 2 -11.43,-7.62; 3 -8.89,-7.62; 4 -6.35,-7.62; 5 -3.81,-7.62; 6 -1.27,-7.62; 7 1.27,-7.62; 8 3.81,-7.62; 9 6.35,-7.62; 10 8.89,-7.62; 11 11.43,-7.62; 12 13.97,-7.62; 13 13.97,7.62; 14 11.43,7.62; 15 8.89,7.62; 16 6.35,7.62; 17 3.81,7.62; 18 1.27,7.62; 19 -1.27,7.62; 20 -3.81,7.62; 21 -6.35,7.62; 22 -8.89,7.62; 23 -11.43,7.62; 24 -13.97,7.62
SIL1X02-100 = drill 0.813 round: 1 -1.27,0 | drill 0.813 octagon: 2 1.27,0
JP10Q = drill 0.914 octagon: 1 -11.43,-1.27; 2 -11.43,1.27; 3 -8.89,-1.27; 4 -8.89,1.27; 5 -6.35,-1.27; 6 -6.35,1.27; 7 -3.81,-1.27; 8 -3.81,1.27; 9 -1.27,-1.27; 10 -1.27,1.27; 11 1.27,-1.27; 12 1.27,1.27; 13 3.81,-1.27; 14 3.81,1.27; 15 6.35,-1.27; 16 6.35,1.27; 17 8.89,-1.27; 18 8.89,1.27; 19 11.43,-1.27; 20 11.43,1.27
JP8Q = drill 0.914 octagon: 1 -8.89,-1.27; 2 -8.89,1.27; 3 -6.35,-1.27; 4 -6.35,1.27; 5 -3.81,-1.27; 6 -3.81,1.27; 7 -1.27,-1.27; 8 -1.27,1.27; 9 1.27,-1.27; 10 1.27,1.27; 11 3.81,-1.27; 12 3.81,1.27; 13 6.35,-1.27; 14 6.35,1.27; 15 8.89,-1.27; 16 8.89,1.27
JP4Q = drill 0.914 octagon: 1 -3.81,-1.27; 2 -3.81,1.27; 3 -1.27,-1.27; 4 -1.27,1.27; 5 1.27,-1.27; 6 1.27,1.27; 7 3.81,-1.27; 8 3.81,1.27
LT1-3/4 = drill 0.813 square: + -1.27,0 | drill 0.813 octagon: - 1.27,0
DIL08-3-TOP = drill 0.813 square: 1 -3.81,3.81 | drill 0.813 octagon: 2 -3.81,1.27; 3 -3.81,-1.27; 4 -3.81,-3.81; 5 3.81,-3.81; 6 3.81,-1.27; 7 3.81,1.27; 8 3.81,3.81
DIL06-3-TOP = drill 0.813 square: 1 -3.81,2.54 | drill 0.813 octagon: 2 -3.81,0; 3 -3.81,-2.54; 4 3.81,-2.54; 5 3.81,0; 6 3.81,2.54
OSC-TOP = drill 0.813 round: 1 -7.62,-3.81; 4 0,-3.81 | drill 0.813 octagon: 7 7.62,-3.81; 8 7.62,3.81; 11 0,3.81; 14 -7.62,3.81 | drill 1.2 pad 1.93 long: S -9.144,0; S@1 9.144,0
5-PIN-90-DEGREE-FEMALE-DIN = drill 1.321 square: 1 7.62,5.08 | drill 1.321 octagon: 2 0,5.08; 3 -7.62,5.08; 4 5.08,7.62; 5 -5.08,7.62; PE@1 -2.54,-5.08; PE@2 2.54,-5.08; PE@5 -5.08,-5.08; PE@6 5.08,-5.08 | drill 2 round: PE@3 7.62,0; PE@4 -7.62,0
LCR5 = drill 0.8 square: 1 -5.08,0 | drill 0.8 octagon: 2 5.08,0
R5-PTH = drill 0.8 square: 1 -5.08,0 | drill 0.8 octagon: 2 5.08,0
TACTILE-PTH = drill 1.016 round: 1 -3.251,2.261; 2 3.251,2.261; 3 -3.251,-2.261; 4 3.251,-2.261

### Placement (x,y rotation side)
C1  16.51,60.96 90 top
C2  11.43,60.96 270 top
C3  57.15,73.66 270 top
C4  16.51,48.26 270 top
C5  44.45,45.72 90 top
C6  49.53,53.34 270 top
C7  22.86,36.83 270 top
C8  82.55,44.45 0 top
C9  53.34,66.04 90 top
C10  49.53,36.83 270 top
CN1  0,21.59 0 top
CN2  93.47,48.26 270 top
D1  62.23,2.54 0 top
GND1  7.11,14.48 0 top
GND2  7.11,82.04 0 top
GND3  2.03,94.49 0 top
GND4  97.03,94.49 0 top
GND5  2.03,2.03 0 top
GND6  97.03,2.03 0 top
IC1  29.21,45.72 0 top
IC2  62.23,50.8 0 top
IC3  62.23,34.29 0 top
IC4  34.29,34.29 0 top
IC5  35.56,72.39 0 top
JP1  13.21,12.7 0 top
JP2  13.21,10.16 0 top
JP3  13.21,7.62 0 top
JP4  13.21,5.08 0 top
JP5  13.21,2.54 0 top
JP6  31.8,25.3 0 top
JP7  60.88,25.48 0 top
JP8  81.97,58.62 0 top
LED1  93.98,7.62 0 top
OC1A  80.01,26.67 0 top
OC1B  80.01,38.1 0 top
OSC1  69.85,69.85 0 top
P1  80.01,7.62 0 top
P2  81.28,88.9 180 top
P3  60.96,88.9 180 top
R1  22.86,2.54 180 top
R2  19.05,92.71 0 top
R3  31.75,92.71 180 top
R4  19.05,88.9 0 top
R5  31.75,88.9 180 top
R6  21.59,54.61 180 top
R7  34.29,54.61 0 top
R8  50.8,2.54 0 top
R9  36.83,2.54 0 top
R10  79.98,19.94 0 top
R11  44.45,85.09 0 top
R12  31.75,85.09 180 top
R13  44.45,88.9 0 top
R14  44.45,92.71 180 top
S1  46.99,11.43 0 top
U$1  [TLE-LOGO-9]  41.73,78.51 270 bottom
U$2  [TLE-LOGO-14]  38.58,5.59 0 bottom

### Tracks (layer width: path | path; a pad name or v marks a point on that pad's centre or on a via)
0XFF6A-B
  Bottom 0.203: IC3.10 68.58,37.19 66.95,35.56 66.95,28.84 65.66,27.54 65.66,26.14 64.69,25.17 JP7.11
0XFF6C-D
  Bottom 0.203: IC3.9 71.12,37.19 67.64,33.71 67.64,28.84 68.2,28.29 68.2,26.14 67.23,25.17 JP7.13
0XFF6E-F
  Bottom 0.203: JP7.15 69.77,25.17 68.58,26.36 IC3.7
0XFF60-1
  Bottom 0.203: IC3.15 55.88,37.19 54.71,36.02 54.71,30.35 52.96,28.6 52.96,26.14 51.99,25.17 JP7.1
0XFF62-3
  Bottom 0.203: IC3.14 58.42,37.19 58.08,36.85 58.08,31.64 57.15,30.71 57.15,28.83 55.7,27.38 55.7,26.34 54.53,25.17 JP7.3
0XFF64-5
  Bottom 0.203: IC3.13 60.96,37.19 59.75,35.98 59.75,29.62 58.57,28.44 58.57,26.67 57.07,25.17 JP7.5
0XFF66-7
  Bottom 0.203: IC3.12 63.5,37.19 62.36,36.04 62.36,29.32 60.58,27.54 60.58,26.14 59.61,25.17 JP7.7
0XFF68-9
  Bottom 0.203: IC3.11 66.04,37.19 64.92,36.06 64.92,29.34 63.12,27.54 63.12,26.14 62.15,25.17 JP7.9
!0XFF6N
  Top 0.203: IC3.4 IC3.5
  Bottom 0.203: IC2.9 71.12,53.7 64.77,47.35 64.77,36.42 63.5,35.15 IC3.5
!A4  (via drill 0.61 pad 1.02)
  Top 0.203: v37.91,46.83 40.4,49.33 50.44,49.33 53.91,52.8 55.69,52.8 57.51,54.61 IC2.14
  Bottom 0.203: IC4.10 36.83,44.44 37.91,45.51 v37.91,46.83
!A7  (via drill 0.61 pad 1.02)
  Top 0.203: IC2.11 65.13,54.61 62.48,51.96 54.59,51.96 47.98,45.36 42.28,45.36 41.81,44.88 v35.42,44.88
  Bottom 0.203: IC4.12 31.75,39.01 31.84,39.1 31.84,42.06 34.66,44.88 v35.42,44.88
!ACIA  (via drill 0.61 pad 1.02)
  Top 0.203: v45.73,26.66 46.05,26.98 50.79,26.98 51.03,26.75 JP7.2 JP7.4 JP7.6 JP7.8 JP7.10 JP7.12 JP7.14 JP7.16
  Bottom 0.203: v45.73,26.66 42.88,29.51 41.49,29.51 40.94,30.07 40.94,31.89 43.18,34.13 43.18,39.59 42.83,39.95 42.83,62.94 41.91,63.85 IC5.9
!CART
  Top 0.203: CN2.8 97.3,63.49 97.3,59.64 96.08,58.42 94.68,58.42 93.47,57.21 93.47,57.04 92.63,56.2 87.89,56.2 86.74,57.35 JP8.7
  Bottom 0.203: R3.1 37.74,92.71 38.72,93.69 39.75,93.69 47.75,85.69 47.75,85.5 49.07,84.18 50.07,84.18 75.63,58.62 83.54,58.62 84.81,57.35 | CN1.8 9.58,64.77 10.57,65.76 11.9,65.76 12.67,64.99 12.67,16.82 10.94,15.1 10.94,6.07 JP4.1 10.99,4.14 10.99,2.16 12.29,0.86 65.66,0.86 69.79,5 69.79,7.58 80.32,18.1 85.13,18.1 86.42,19.39 86.42,54.77 84.81,56.37 84.81,57.35 | 84.81,57.35 JP8.7
!CTS  (via drill 0.61 pad 1.02)
  Top 0.203: v9.91,34.42 11.99,36.5 36.57,36.5 38.1,38.03 38.1,38.16 39.01,39.06 43.2,39.06 47.65,34.61 58.25,34.61 58.53,34.89 65.47,34.89 69.7,30.67 69.7,30.5 70.69,29.51 72.37,29.51 75.05,32.2 86.47,32.2 87.92,30.74 92.53,30.74 93.67,31.88 93.67,32.04 95,33.38 96.01,33.38 CN2.32
  Bottom 0.203: v9.91,34.42 8,34.42 7.87,34.29 CN1.32
!CUSTOM_IRQ0  (via drill 0.61 pad 1.02)
  Top 0.762: JP2.1 10.26,8.48 10.26,2.45 11.42,1.29 20.16,1.29 26.2,7.34 35.93,7.34 39.11,10.52 80.09,10.52 82.59,13.02 82.59,14.97 84.44,16.82 87.91,16.82 v88.16,16.56 | CN1.1 18.37,72.39 25.4,79.42 25.4,80.52 26.87,81.98 49.84,81.98 52.57,79.25 82.83,79.25 89.69,72.39 CN2.1
  Bottom 0.762: v88.16,16.56 87.93,16.8 87.93,18.16 88.51,18.75 88.51,69.24 90.41,71.14 90.93,71.14 CN2.1
!CUSTOM_IRQ1  (via drill 0.61 pad 1.02)
  Top 0.762: v89.02,17.71 88.95,17.78 84.04,17.78 83.97,17.71 43.44,17.71 34.64,8.91 13.23,8.91 JP3.1 | v12.86,81.39 17.8,86.33 83.56,86.33 88.25,81.64 88.25,81.32 95.93,73.64 96.01,73.64 CN2.2
  Bottom 0.762: CN1.2 9.08,72.39 12.86,76.17 v12.86,81.39 | CN2.2 96.01,71.14 94.24,71.14 93.5,70.4 93.5,69.35 92.75,68.61 90.42,68.61 89.61,67.8 89.61,18.3 v89.02,17.71
!HALT
  Top 0.203: CN1.3 17.84,69.85 27.94,79.95 27.94,80.09 29.14,81.3 47.07,81.3 48.26,80.11 48.26,79.95 50.16,78.06 81.81,78.06 90.02,69.85 CN2.3
!IRQ
  Top 0.203: IC5.7 37.74,64.77 41.3,61.21 75.87,61.21 77.19,59.89 JP8.2 JP8.4 JP8.6 JP8.8
!IRQ0
  Top 0.203: R6.2 20.08,54.61 24.95,59.48 75.06,59.48 77.19,57.35 JP8.1
  Bottom 0.203: 16.51,54.65 13.51,51.65 13.51,4.42 14.48,3.45 JP5.2 | 16.51,54.65 R6.2 | 16.51,54.65 16.51,55.52 14.88,57.15 14.88,87.08 13.97,87.99 R4.1
!IRQ1  (via drill 0.61 pad 1.02)
  Top 0.203: R7.2 41.16,54.61 v41.75,55.2 45.67,59.13 73.51,59.13 76.28,56.35 78.73,56.35 79.73,57.35 JP8.3
  Bottom 0.203: JP5.1 13.26,1.22 21.83,1.22 44.22,23.61 44.22,26.95 42.52,28.65 41.84,28.65 40.55,29.95 40.55,32.25 42.83,34.53 42.83,39.27 41.75,40.34 v41.75,55.2 | R5.1 37.74,88.9 37.74,88.45 40.32,85.87 40.32,56.47 39.37,55.52 R7.2
!KHZ31.25
  Bottom 0.203: IC1.9 38.1,48.62 39.08,47.63 39.08,39.23 37.97,38.12 37.97,32.96 38.45,32.48 38.45,30.1 39.29,29.27 39.41,29.27 42.27,26.41 42.27,25.96 43.23,24.99 JP6.19
!NMI
  Top 0.203: JP8.5 84.2,57.35 85.71,55.84 96.05,55.84 98.02,57.81 98.02,66.93 96.01,68.94 CN2.4 96.01,70.76 97.02,71.77 97.02,81.67 91.67,87.02 20.57,87.02 14.88,92.71 R2.1
  Bottom 0.203: 8.62,69.85 CN1.4 | 8.62,69.85 13.71,74.94 13.71,81.69 13.02,82.39 13.02,90.85 13.97,91.8 R2.1 | 8.62,69.85 13.15,65.32 13.15,2.5 14.08,1.58 14.87,1.58 15.41,2.12 15.41,3.23 14.48,4.17 JP4.2
!RESET  (via drill 0.61 pad 1.02)
  Top 0.203: IC1.10 36.47,49.53 37.69,50.75 51.36,50.75 54.97,54.35 54.97,54.61 IC2.15 | v86.45,67.18 89.89,67.18 90.02,67.31 CN2.5 | CN1.5 8.66,67.31 10.8,65.17 10.8,64.66 11.24,64.21 17.27,64.21 21.24,68.19 34.76,68.19 34.95,67.99 v39.37,67.99 50.68,67.99 52.27,66.4 61.87,66.4 OSC1.1 OSC1.4 | S1.1 S1.2
  Bottom 0.203: v86.45,67.18 84.34,65.06 70.83,65.06 OSC1.4 | v39.37,67.99 IC5.8 | OSC1.1 55.88,59.69 IC2.15 55.88,53.7 54.61,52.42 54.61,45.96 51.86,43.21 51.86,33.62 49.73,31.48 49.73,14.21 S1.2
!SCS  (via drill 0.61 pad 1.02)
  Top 0.203: v10.11,29.34 25.63,29.34 26.28,28.7 43.29,28.7 46.36,31.78 66.04,31.78 67.31,30.5 67.31,30.38 68.54,29.14 72.64,29.14 75.34,31.84 85.82,31.84 87.53,30.12 96.01,30.12 CN2.36
  Bottom 0.203: v10.11,29.34 8.01,29.34 7.87,29.21 CN1.36 | v10.11,29.34
!SLENB  (via drill 0.61 pad 1.02)
  Top 0.203: v9.8,23.06 72.55,23.06 73.33,23.84 89.8,23.84 90.43,23.21 96.01,23.21 CN2.40
  Bottom 0.203: v9.8,23.06 8.73,24.13 CN1.40
A0  (via drill 0.61 pad 1.02)
  Top 0.203: CN1.19 7.87,49.53 7.96,49.62 11.79,49.62 14.47,52.29 37.67,52.29 37.71,52.25 44.46,52.25 49.14,56.94 v49.65,56.94 50.06,57.34 72.63,57.34 79.2,50.77 88.78,50.77 90.02,49.53 CN2.19
  Bottom 0.203: v49.65,56.94 49.65,61.19 46.99,63.85 IC5.11
A1  (via drill 0.61 pad 1.02)
  Top 0.203: v11.9,27.71 12.19,27.99 43.83,27.99 46.32,30.48 IC3.1 54.63,29.19 55.98,29.19 57.1,28.08 74.64,28.08 75.42,28.86 85.11,28.86 86.07,27.9 96.56,27.9 97.37,28.71 97.37,47.26 96.01,48.62 CN2.20
  Bottom 0.203: CN1.20 7.87,49.53 7.96,49.62 10.06,49.62 12.24,47.43 12.24,28.05 v11.9,27.71
A2  (via drill 0.61 pad 1.02)
  Top 0.203: CN1.21 11.22,46.99 15.82,51.58 37.38,51.58 37.42,51.54 44.79,51.54 49.06,55.82 50.12,55.82 50.31,56.01 v57.29,56.01 57.91,56.63 72.33,56.63 79.61,49.35 87.66,49.35 90.02,46.99 CN2.21
  Bottom 0.203: v57.29,56.01 56.85,55.57 56.85,32.37 55.88,31.39 IC3.2
A3  (via drill 0.61 pad 1.02)
  Top 0.203: v9.74,48.84 12.1,48.84 15.19,51.94 37.52,51.94 37.56,51.9 44.61,51.9 48.88,56.17 49.97,56.17 50.78,56.99 72.48,56.99 79.71,49.76 89.11,49.76 90.97,47.9 96.01,47.9 CN2.22 96.01,46.08 97.01,45.08 97.01,28.89 96.38,28.25 86.72,28.25 85.73,29.24 74.77,29.24 73.96,28.43 61.38,28.43 59.33,30.48 IC3.3
  Bottom 0.203: CN1.22 8.7,46.99 9.74,48.03 v9.74,48.84
A4  (via drill 0.61 pad 1.02)
  Top 0.203: CN2.23 89,44.45 85.39,48.06 79.47,48.06 71.61,55.92 63.44,55.92 62.23,54.71 62.23,54.44 60.23,52.44 54.56,52.44 48.19,46.07 37.12,46.07 v36.69,45.65 34.29,48.05 34.29,49.6 33.02,50.87 16.21,50.87 14.03,48.69 14.03,48.31 10.11,44.39 7.93,44.39 7.87,44.45 CN1.23
  Bottom 0.203: IC4.11 34.29,42.53 36.69,44.93 v36.69,45.65
A5  (via drill 0.61 pad 1.02)
  Top 0.203: v9.79,45.2 10.04,45.2 10.04,45.21 16.06,51.23 37.23,51.23 37.3,51.16 51.25,51.16 54.58,54.49 54.58,54.73 55.43,55.58 56.65,55.58 56.97,55.25 57.64,55.25 57.92,55.53 59.13,55.53 60.05,54.61 IC2.13 61.87,54.61 61.87,54.89 63.26,56.28 71.96,56.28 79.24,48.99 86.33,48.99 89.96,45.36 96.01,45.36 CN2.24
  Bottom 0.203: CN1.24 9.04,44.45 v9.79,45.2
A6
  Top 0.203: CN1.25 13.9,41.91 14.9,40.91 45.13,40.91 55.8,51.58 64.38,51.58 66.96,54.16 66.96,55.56 | 66.96,55.56 71.46,55.56 80.17,46.85 85.08,46.85 90.02,41.91 CN2.25 | 66.96,55.56 65.37,55.56 64.42,54.61 IC2.12
A7  (via drill 0.61 pad 1.02)
  Top 0.203: v31.86,53.06 37.41,53.06 37.86,52.61 44.31,52.61 48.64,56.94 48.64,57.01 49.33,57.7 72.93,57.7 79.5,51.12 v93.33,51.12 | v11.48,38.97 11.59,39.07 27.32,39.07 28.3,38.1 IC4.13
  Bottom 0.203: CN1.26 8.63,41.91 11.48,39.06 v11.48,38.97 | v31.86,53.06 29.21,50.41 IC4.13 | CN2.26 96.01,42.83 95,42.83 93.33,44.5 v93.33,51.12
A8
  Top 0.203: 68.58,52.7 65.93,50.05 54.77,50.05 45.27,40.55 10.15,40.55 8.96,39.37 CN1.27 | 68.58,52.7 75.89,45.4 84.18,45.4 90.02,39.56 90.02,39.37 CN2.27 | 68.58,52.7 IC2.10
A9  (via drill 0.61 pad 1.02)
  Top 0.203: v9.96,39.27 10.88,40.2 50.4,40.2 57.15,46.95 57.15,47.04 58.44,48.34 66.32,48.34 67.67,46.99 IC2.7 69.5,46.99 72.94,43.54 84.69,43.54 89.78,38.46 96.01,38.46 CN2.28
  Bottom 0.203: v9.96,39.27 7.97,39.27 7.87,39.37 CN1.28
A10
  Top 0.203: CN1.29 8.62,36.83 10.72,38.93 10.72,39.28 11.28,39.84 52.61,39.84 59.69,46.93 59.69,47.05 60.56,47.92 64.19,47.92 65.13,46.99 IC2.6 66.95,46.99 70.76,43.19 84.29,43.19 90.64,36.83 CN2.29
A11  (via drill 0.61 pad 1.02)
  Top 0.203: v58.84,34.13 48.21,34.13 43.2,29.12 26.45,29.12 23.58,31.99 v11.48,31.99 | CN2.30 96.01,35.92 90.55,35.92 83.87,42.59 68.81,42.59 64.42,46.99 IC2.5
  Bottom 0.203: CN1.30 8.67,36.83 11.48,34.02 v11.48,31.99 | IC2.5 63.5,46.08 59.82,42.39 59.82,38.2 58.84,37.23 v58.84,34.13
A12
  Top 0.203: 61.42,46.99 53.91,39.49 36.85,39.49 35.56,38.2 35.56,38.03 34.67,37.13 11.5,37.13 8.66,34.29 CN1.31 | 61.42,46.99 61.87,46.99 67.11,41.75 84.11,41.75 90.65,35.2 90.93,35.2 CN2.31 | 61.42,46.99 IC2.4
A13  (via drill 0.61 pad 1.02)
  Top 0.203: 55.67,27.73 44.38,27.73 44.28,27.62 13.47,27.62 12.52,26.67 CN1.37 | 55.67,27.73 55.67,27.72 72.52,27.72 73.21,27.03 89.66,27.03 90.02,26.67 CN2.37 | 55.67,27.73 v55.67,28.43
  Bottom 0.203: IC2.3 58.42,46.08 57.51,45.16 57.51,32.04 56.79,31.33 56.79,29.55 v55.67,28.43
A14  (via drill 0.61 pad 1.02)
  Top 0.203: v9.7,25.55 46.75,25.55 47.37,26.18 v50.49,26.18 50.91,25.76 75.26,25.76 75.84,26.33 86.98,26.33 87.56,25.76 96.01,25.76 CN2.38
  Bottom 0.203: v50.49,26.18 50.49,27.48 52.38,29.37 52.38,42.57 55.88,46.08 IC2.2 | CN1.38 8.66,26.67 9.7,25.63 v9.7,25.55
A15  (via drill 0.61 pad 1.02)
  Top 0.203: CN1.39 9.62,24.13 10.56,25.07 48.71,25.07 v48.9,25.26 72.43,25.26 73.23,24.46 89.68,24.46 90.02,24.13 CN2.39
  Bottom 0.203: IC2.1 51.5,45.15 51.5,35.37 48.9,32.77 v48.9,25.26
ACIACLK
  Top 0.203: JP6.2 JP6.4 JP6.6 JP6.8 JP6.10 JP6.12 JP6.14 JP6.16 JP6.18 JP6.20
  Bottom 0.203: 27.94,62.59 29.21,63.85 IC5.4 | JP6.8 27.99,26.87 24.6,30.25 24.6,40.66 24.41,40.85 24.41,47.14 26.57,49.3 26.57,50.97 27.94,52.34 27.94,62.59 | 27.94,62.59 26.67,63.85 IC5.3
ACIAIN  (via drill 0.61 pad 1.02)
  Top 0.203: v36.83,21.19 72.74,21.19 74,19.94 R10.1
  Bottom 0.203: 32.02,30.48 32.02,30.61 30.8,31.82 30.8,39.51 31.47,40.17 31.47,51.58 32.63,52.75 32.63,60.74 30.17,63.2 30.17,65.1 29.56,65.71 28.63,65.71 28.36,65.44 27.73,65.44 27.46,65.71 25.99,65.71 25.04,64.77 IC5.2 | 32.02,30.48 32.66,30.48 34.65,28.5 34.65,26.09 35.49,25.25 35.76,25.25 36.83,24.18 v36.83,21.19 | 32.02,30.48 IC4.3 | 82.86,20.79 84.68,18.96 85.47,18.96 86.03,19.52 86.03,32.43 83.82,34.65 OC1B.4 | 82.86,20.79 82.86,23.52 83.82,24.48 OC1A.6 | R10.1 82.01,19.94 82.86,20.79
ACIAOUT
  Bottom 0.203: 34.29,63.85 | 34.29,63.85 34.29,55.1 39.49,49.9 39.49,39.14 39.37,39.01 IC4.9 | 34.29,63.85 IC5.6
AGND
  Top 0.762: 75.89,2.54 75.89,4.12 P1.PE@4 | P1.PE@2 P1.PE@1 76.2,2.54 75.89,2.54 | P1.PE@5 75.89,2.54
  Bottom 0.762: 90.5,87.3 90.5,74.8 87.55,71.84 87.55,19.15 86.96,18.56 86.96,16.22 89.21,13.97 89.21,9.2 P1.PE@3 84.12,4.12 84.12,2.54 | P1.PE@2 83.82,2.54 84.12,2.54 | 84.12,2.54 P1.PE@6
D0  (via drill 0.61 pad 1.02)
  Top 0.203: v9.76,63.38 18.21,63.38 21.81,66.98 v24.65,66.98 25.13,67.45 33.2,67.45 33.78,66.87 48.79,66.87 49.98,65.69 54.07,65.69 55.5,64.25 85.45,64.25 88.87,60.84 95.54,60.84 96.01,61.32 CN2.10
  Bottom 0.203: CN1.10 8.63,62.23 9.76,63.35 v9.76,63.38 | IC5.22 26.67,69 v24.65,66.98
D1  (via drill 0.61 pad 1.02)
  Top 0.203: CN2.11 89.51,59.69 85.45,63.76 44.08,63.76 43.14,64.69 43.14,64.93 41.57,66.51 31.36,66.51 30.89,66.98 26.18,66.98 v25.89,66.69 25,65.8 23.85,65.8 22.9,64.85 22.9,64.58 17.1,58.78 10.37,58.78 9.46,59.69 CN1.11
  Bottom 0.203: IC5.21 29.21,70.01 v25.89,66.69
D2  (via drill 0.61 pad 1.02)
  Top 0.203: v11.56,64.98 16.72,64.98 IC5.20 32.66,80.01 36.48,76.19 76.36,76.19 86.87,65.69 92.65,65.69 93.18,65.16 93.18,64.98 94.66,63.5 96.04,63.5 96.93,62.61 96.93,61.52 96.01,60.6 CN2.12
  Bottom 0.203: CN1.12 8.64,59.69 10.52,61.57 10.52,63.94 v11.56,64.98
D3  (via drill 0.61 pad 1.02)
  Top 0.203: CN1.13 7.87,57.15 8.21,57.48 18.21,57.48 25.4,64.68 25.4,64.79 26.81,66.2 v28.04,66.2 28.45,65.8 39.68,65.8 40.64,64.83 40.64,64.71 42.66,62.69 84.48,62.69 90.02,57.15 CN2.13
  Bottom 0.203: IC5.19 34.29,72.45 v28.04,66.2
D4  (via drill 0.61 pad 1.02)
  Top 0.203: v36.28,63.44 25.07,63.44 18.35,56.72 v9.58,56.72 | CN2.14 96.01,58.06 96.26,58.06 97.65,59.45 97.65,64.44 96.05,66.04 94.71,66.04 93.83,66.92 93.83,67.04 92.65,68.22 87.45,68.22 78.68,76.99 40.76,76.99 37.74,80.01 IC5.18
  Bottom 0.203: IC5.18 36.83,66.72 35.91,65.8 35.91,63.81 v36.28,63.44 | CN1.14 9.15,57.15 v9.58,56.72
D5  (via drill 0.61 pad 1.02)
  Top 0.203: CN2.15 84.59,54.61 81.66,57.54 81.66,57.81 80.85,58.62 77.19,58.62 75.35,60.46 40.89,60.46 v37.76,63.59 36.09,61.93 25.12,61.93 19.56,56.37 11.92,56.37 10.16,54.61 CN1.15
  Bottom 0.203: IC5.17 39.37,79.1 37.76,77.48 v37.76,63.59
D6  (via drill 0.61 pad 1.02)
  Top 0.203: v11.19,53.64 30.15,53.64 31.07,54.57 37.96,54.57 38.86,53.68 41.3,53.68 44.12,56.49 v45.54,56.49 47.82,58.77 73.36,58.77 78.44,53.7 96.01,53.7 CN2.16
  Bottom 0.203: v11.19,53.64 10.22,54.61 CN1.16 | IC5.16 41.91,67 43.18,65.73 43.18,58.85 v45.54,56.49
D7  (via drill 0.61 pad 1.02)
  Top 0.203: CN2.17 79.06,52.07 73.08,58.05 48.68,58.05 v47.88,57.26 47.88,57.11 43.73,52.96 38.01,52.96 37.15,53.82 31.55,53.82 30.53,52.8 14.18,52.8 13.45,52.07 CN1.17
  Bottom 0.203: v47.88,57.26 45.43,59.71 45.43,78.12 44.45,79.1 IC5.15
E  (via drill 0.61 pad 1.02)
  Top 0.203: v9.47,67.59 18.08,67.59 30.78,80.28 30.78,80.41 31.31,80.94 45.15,80.94 46.08,80.01 IC5.14 49.65,77.35 79.58,77.35 88.35,68.58 95.66,68.58 96.01,68.22 CN2.6
  Bottom 0.203: IC3.6 66.04,35.21 66.95,36.12 66.95,37.86 69.81,40.72 69.81,47.21 72.07,49.47 72.07,61.68 52.78,80.97 48.86,80.97 47.9,80.01 IC5.14 | v9.47,67.59 8.15,67.59 7.87,67.31 CN1.6
GND  (via drill 0.61 pad 1.02)
  Top 0.762: IC5.1 C1.- C2.- | 92.86,15.24 92.86,15.42 85.42,22.86 OC1A.5 | C4.- 22.13,46.99 24.16,49.01 24.16,49.53 IC1.14 26.64,49.53 26.64,49.01 27.37,48.28 30.48,48.28 | 30.48,48.28 30.48,48.27 35.59,43.16 36.08,43.16 36.85,42.38 36.85,41.91 IC1.8 40.72,41.91 43.26,44.45 C5.- | 92.86,15.24 CN2.84 95.96,15.24 95.96,14.65 95.98,14.63 | v9.72,31.75 9.72,31.77 13.51,35.56 C7.- 39.12,35.56 41.91,32.77 IC4.7 | 95.98,14.63 96.01,14.63 CN2.85 | 95.98,14.63 95.98,9.6 95.25,8.87 LED1.- | R9.1 32.99,2.54 39.62,9.17 S1.3 | 30.48,48.28 IC1.12 | v9.72,31.75 | v9.72,31.75 CN1.34 | OSC1.7 76.22,66.04 72.42,69.85 OSC1.S | 57.15,71.2 58.5,69.85 OSC1.S | OSC1.S | 57.15,71.2 C3.- | C9.- 53.34,68.5 56.04,71.2 57.15,71.2 | C10.- 50.72,35.56 50.74,35.58 66.02,35.58 IC3.8 72.36,30.48 75.1,33.22 77.69,33.22 82.58,38.1 OC1B.5 85.06,38.1 90.17,32.99 90.93,32.99 CN2.33 | GND2.GND 10.92,82.04 10.92,81.78 12.7,80.01 IC5.24 IC5.23 | CN2.82 96.01,80.06 95.96,80.11 95.96,81.28 CN2.81 90.98,81.28 90.98,80.11 90.93,80.06 CN2.83 | 92.86,15.24 CN2.86
  Bottom 0.762: C4.- 16.51,48.18 15.77,48.18 15.27,48.67 15.27,51.21 17.78,53.71 17.78,58.42 C1.- | CN1.34 8.2,31.75 8.21,31.75 v9.72,31.75 11.25,30.23 11.25,28.93 10.74,28.43 10.74,27.33 10.92,27.15 10.92,18.29 GND1.GND 7.11,9.6 2.03,4.52 GND5.GND | IC5.1 IC5.24 | 49.53,36.75 50.28,36.75 50.72,37.18 50.72,49.69 49.53,50.88 C6.- 50.72,52.07 50.72,55.6 52.15,57.03 52.15,67.31 C9.- | OC1B.5 83.82,39.34 84.29,39.34 85.11,40.16 85.11,41.98 83.82,43.26 C8.- 82.63,44.45 82.63,45.19 80.83,46.99 IC2.8 | GND6.GND 97.03,4.52 95.25,6.3 LED1.- | CN2.84 93.47,17.73 97.31,21.56 97.31,29.73 96.53,30.5 96.01,30.5 CN2.34 96.01,32.99 90.93,32.99 CN2.33 | GND3.GND 2.03,92 7.11,86.92 GND2.GND | 92.92,87.89 92.92,84.32 93.47,83.77 CN2.81 | 92.92,87.89 97.03,92 GND4.GND | 92.92,87.89 89.8,91.02 88.02,91.02 83.55,86.55 83.55,76.92 78.99,72.36 OSC1.S@1 78.99,67.33 78.72,67.06 78.72,66.04 OSC1.7 | 47.23,12.14 46.71,12.14 S1.3 | S1.4 47.27,12.14 47.23,12.14 | 47.23,30.48 47.23,12.14 | 47.23,30.48 47.23,32.08 49.53,34.37 C10.- 49.53,36.75 | IC4.7 47.23,30.48 | C5.- 44.45,41.08 48.78,36.75 49.53,36.75
  pour Bottom (hatched): 0,96.52 99.06,96.52 99.06,0 0,0
  pour Top (hatched): 0,96.52 99.06,96.52 99.06,0 0,0
KHZ62.5
  Bottom 0.203: JP6.17 40.69,24.99 39.73,25.96 39.73,27.02 38.03,28.71 38.03,32.34 35.56,34.81 IC1.7
KHZ125
  Bottom 0.203: JP6.15 38.15,24.99 37.19,25.96 37.19,27.64 35.56,29.26 35.56,31.39 33.02,33.94 IC1.6
KHZ250
  Bottom 0.203: JP6.13 34.29,25.35 34.29,26.75 32.09,28.95 31.93,28.95 30.76,30.13 30.76,31.36 30.4,31.72 30.4,40.92 30.48,40.99 IC1.5
KHZ500
  Bottom 0.203: JP6.11 33.07,24.99 32.1,25.96 32.1,27.23 30.22,29.11 30.22,31.22 27.94,33.5 IC1.4
MHZ1
  Bottom 0.203: IC1.3 25.4,40.99 25.31,40.91 25.31,30.5 27.21,28.61 27.32,28.61 29.57,26.36 29.57,25.96 30.53,24.99 JP6.9
MHZ2
  Bottom 0.203: IC1.2 22.86,40.99 23.89,39.97 23.89,29.74 24.48,29.14 24.48,26.16 25.29,25.35 25.7,25.35 27.03,24.03 JP6.7
MHZ4
  Bottom 0.203: IC1.1 20.32,32.8 24.13,28.99 24.13,25.95 25.09,24.99 25.45,24.99 JP6.5
MHZ8
  Bottom 0.203: IC1.15 22.86,48.62 24.05,47.42 24.05,40.3 24.24,40.12 24.24,30.01 26.72,27.53 26.72,26.4 27.52,25.6 27.86,25.6 28.96,24.5 28.96,23.62 28.36,23.02 24.88,23.02 23.88,24.03 JP6.3
MHZ16  (via drill 0.61 pad 1.02)
  Top 0.203: OSC1.8 76.56,73.66 74.38,75.84 42.26,75.84 v35.22,68.8 | IC1.13 28.86,49.53 29.83,50.5 31.13,50.5 32.1,49.53 IC1.11
  Bottom 0.203: v35.22,68.8 33.02,66.6 IC1.11 | JP6.1 21.34,24.03 22.71,22.65 30.55,22.65 31.54,23.64 31.54,26.96 29.77,28.73 29.67,28.73 27.94,30.45 27.94,31.93 25.67,34.2 25.67,40.76 27.03,42.12 27.03,47.7 27.94,48.62 IC1.13
N$1
  Top 0.203: LED1.+ 91.8,7.62 85.38,1.21 30.18,1.21 28.85,2.54 R1.1
N$2
  Top 0.203: JP1.2 14.48,11.79 13.15,10.46 13.15,9.94 12.1,8.89 11.84,8.89 10.94,8 10.94,7.22 12.02,6.15 12.16,6.15 13.56,4.75 13.56,4.61 14.49,3.68 15.73,3.68 16.87,2.54 R1.2
N$3
  Bottom 0.762: JP2.2 14.48,11.4 14.99,11.4 18.11,14.52 18.11,50.64 21.93,54.46 21.93,54.95 22.57,55.59 24.45,55.59 25.43,54.61 R6.1
N$4  (via drill 0.61 pad 1.02)
  Top 0.762: v23.02,54.5 24.37,55.85 27.59,55.85 27.97,55.46 27.97,54.61 R7.1
  Bottom 0.762: v23.02,54.5 23.02,53.99 19.07,50.05 19.07,12.95 14.99,8.87 14.48,8.87 JP3.2
N$13
  Top 0.203: R8.2 D1.C
  Bottom 0.203: OC1B.1 76.2,39.73 75.28,38.81 75.28,29.67 76.11,28.86 76.2,28.86 OC1A.2 76.2,27.03 58.42,9.24 D1.C
N$14
  Bottom 0.203: D1.A 66.04,4.58 74.93,13.47 P1.5 74.93,16.48 73.98,17.43 73.98,22.27 76.2,24.48 OC1A.3 76.2,26.31 77.17,27.28 77.17,36.22 76.2,37.19 OC1B.2
N$15
  Top 0.203: IC4.8 41.91,37.19 42.88,36.22 42.88,29.99 42.37,29.48 27.67,29.48 IC4.1
N$16  (via drill 0.61 pad 1.02)
  Top 0.203: IC4.2 30.12,30.48 34,34.36 v38.78,34.36
  Bottom 0.203: v38.78,34.36 40.32,35.9 40.32,51.53 35.5,56.35 35.5,65.96 35.98,66.44 35.98,70.03 35.91,70.1 35.91,80.72 39.37,84.18 R11.1
N$17
  Top 0.203: R11.2 81.82,85.09 85.11,81.8 85.11,81.28 P2.5
N$18
  Top 0.203: P1.4 85.09,13.99 80.52,9.43 53.51,9.43 46.63,2.54 R8.1
N$19
  Bottom 0.203: R9.2 42.82,2.54 43.73,3.45 50.47,3.45 74.2,27.18 74.2,40.36 75.4,41.55 76.99,41.55 80.7,37.84 80.7,31.06 OC1A.7
N$20
  Top 0.203: P2.4 74.95,81.28 73.66,82.58 50.21,82.58 48.61,84.18 38.53,84.18 37.74,84.98 37.74,85.09 R12.1
N$21
  Bottom 0.203: R14.1 49.53,91.8 50.44,90.89 50.44,89.19 55.88,83.75 P3.4
N$22
  Bottom 0.203: P3.5 64.8,81.28 63.54,80.03 54.73,80.03 51.88,82.88 51.88,85.64 49.53,87.99 R13.2
N$23
  Bottom 0.203: R13.1 39.37,87.99 40.68,86.68 40.68,34.22 39.37,32.91 IC4.6
N$24
  Top 0.203: IC4.4 IC4.5
Q
  Top 0.203: CN1.7 10.19,64.77 11.1,63.86 17.91,63.86 21.86,67.81 34.63,67.81 35.21,67.23 50.76,67.23 51.95,66.04 54.47,66.04 55.9,64.61 85.79,64.61 89.17,61.23 92.5,61.23 93.18,61.9 93.18,62.61 91.93,63.85 90.93,63.85 CN2.7
R/!W  (via drill 0.61 pad 1.02)
  Top 0.203: v9.82,52.86 13.04,52.86 13.33,53.16 30.26,53.16 31.3,54.2 37.83,54.2 38.71,53.32 43.01,53.32 v43.84,54.15 44.27,54.15 46.69,56.57 46.69,57.15 47.96,58.42 73.22,58.42 78.65,52.98 96.01,52.98 CN2.18
  Bottom 0.203: v9.82,52.86 9.03,52.07 CN1.18 | IC5.13 49.53,79.1 46.07,75.64 46.07,64.27 48.64,61.7 48.64,56.92 45.87,54.15 v43.84,54.15
SND
  Top 0.203: CN2.35 86.94,29.21 84.69,31.46 75.46,31.46 72.79,28.79 66.37,28.79 64.77,30.39 64.77,30.5 63.85,31.42 46.51,31.42 43.43,28.35 25.74,28.35 25.52,28.57 9.81,28.57 9.17,29.21 CN1.35
VCC
  Top 0.762: 89.69,62.23 89.36,62.23 84.29,67.29 77.46,67.29 71.09,73.66 OSC1.11 OSC1.14 60.98,73.66 | 89.69,62.23 | JP1.1 17.94,18.7 82.59,18.7 83.83,19.94 R10.2 | C10.+ IC3.16 54.59,38.1 54.59,38.57 55.36,39.34 81.28,39.34 82.58,40.64 OC1B.6 | C3.+ 58.34,74.93 59.61,73.66 60.98,73.66 | 60.98,73.66 | C4.+ IC1.16 | R5.2 R4.2 | IC5.10 45.7,64.77 45.7,65.23 46.47,66.02 47.51,66.02 48.28,65.23 48.28,64.77 IC5.12 C9.+ | C7.+ IC4.14 | C1.+ C2.+ CN1.9 | 89.69,62.23 CN2.9 | C6.+ IC2.16 | R3.2 R2.2
  Bottom 0.762: C10.+ 49.53,41.09 44.82,45.8 44.45,45.8 C5.+ 44.45,48.71 49.16,53.42 49.53,53.42 C6.+ | 28.57,89.57 27.91,88.9 R5.2 | 39.37,91.02 30.03,91.02 28.57,89.57 | 28.57,89.57 26.67,91.47 R3.2 | 39.37,91.02 39.41,91.02 43.18,87.25 43.18,67.28 44.45,66.02 IC5.10 | C7.+ 22.86,39.29 21.57,40.58 21.57,47.04 20.32,48.28 IC1.16 | C4.+ 16.51,50.72 18.74,52.95 18.74,59.18 16.88,61.04 16.51,61.04 C1.+ 16.51,77.47 24.13,85.09 | 24.13,85.09 R12.2 | R4.2 24.13,85.09 | C8.+ 81.28,43.26 82.44,43.26 83.82,41.88 OC1B.6 82.58,40.64 82.58,32.97 83.82,31.73 OC1A.8 83.82,29.23 84.34,29.23 85.11,28.46 85.11,21.23 85.06,21.18 R10.2 | IC2.16 C9.+ 53.34,65.96 53.71,65.96 54.53,66.78 54.53,71.49 56.78,73.74 57.15,73.74 C3.+ | 39.37,91.02 R14.2

### Text on the board
Top: 1N914
tPlace: R2 | R3 | R14 | 4K7 | 4K7 | 220R | R4 | R5 | R13 | 4K7 | 4K7 | 220R | R12 | R11 | 220R | 220R | MIDI THRU | MIDI OUT | 68B50 63B50 63C50 | OR EQUIVALENT A.C.I.A. | 100nF | IC5 | 220uF | 100nF | JP8 | 680R.5R | 680R.5R | 100nF | !NMI | !IRQ1 | !IRQ0 | !CART | 100nF | 220nF | 10uF | 100nF | 100nF | PC-900 | Memory Map | Memory Map | JP6 | 6N138 | JP7 | 270R | R10 | MIDI IN | 8MHz | 4MHz | 2MHz | 1MHz | 16MHz | !31.25KHz | 500KHz | 250KHz | 125KHz | 62.5KHz | JP1 - L.E.D. Enable | 0XFF60-1 | 0XFF62-3 | 0XFF64-5 | 0XFF66-7 | 0XFF68-9 | 0XFF6A-B | 0XFF6C-D | 0XFF6E-F | JP2 | JP3 | RESET | LED | JP4 | R1 | R9 | R8 | JP5 | 180R | 10K | 220R
bPlace: http://www.TheLittleEngineers.org/ | Original by: http://www.GIMEchip.com/ | CC-FlexiMIDI-V1R1-03.09.2009 | Released under a Creative Commons | Attribution-ShareAlike 4.0 International | (CC BY-SA 4.0) License | In Memory of my Father, | Robert Embry Turner. | I LOVE YOU DAD, R.I.P.